# EAGLE design valve_indicatorV1 (EAGLE 9.6.2)

## Sheet 1 of 3: Power Regulators
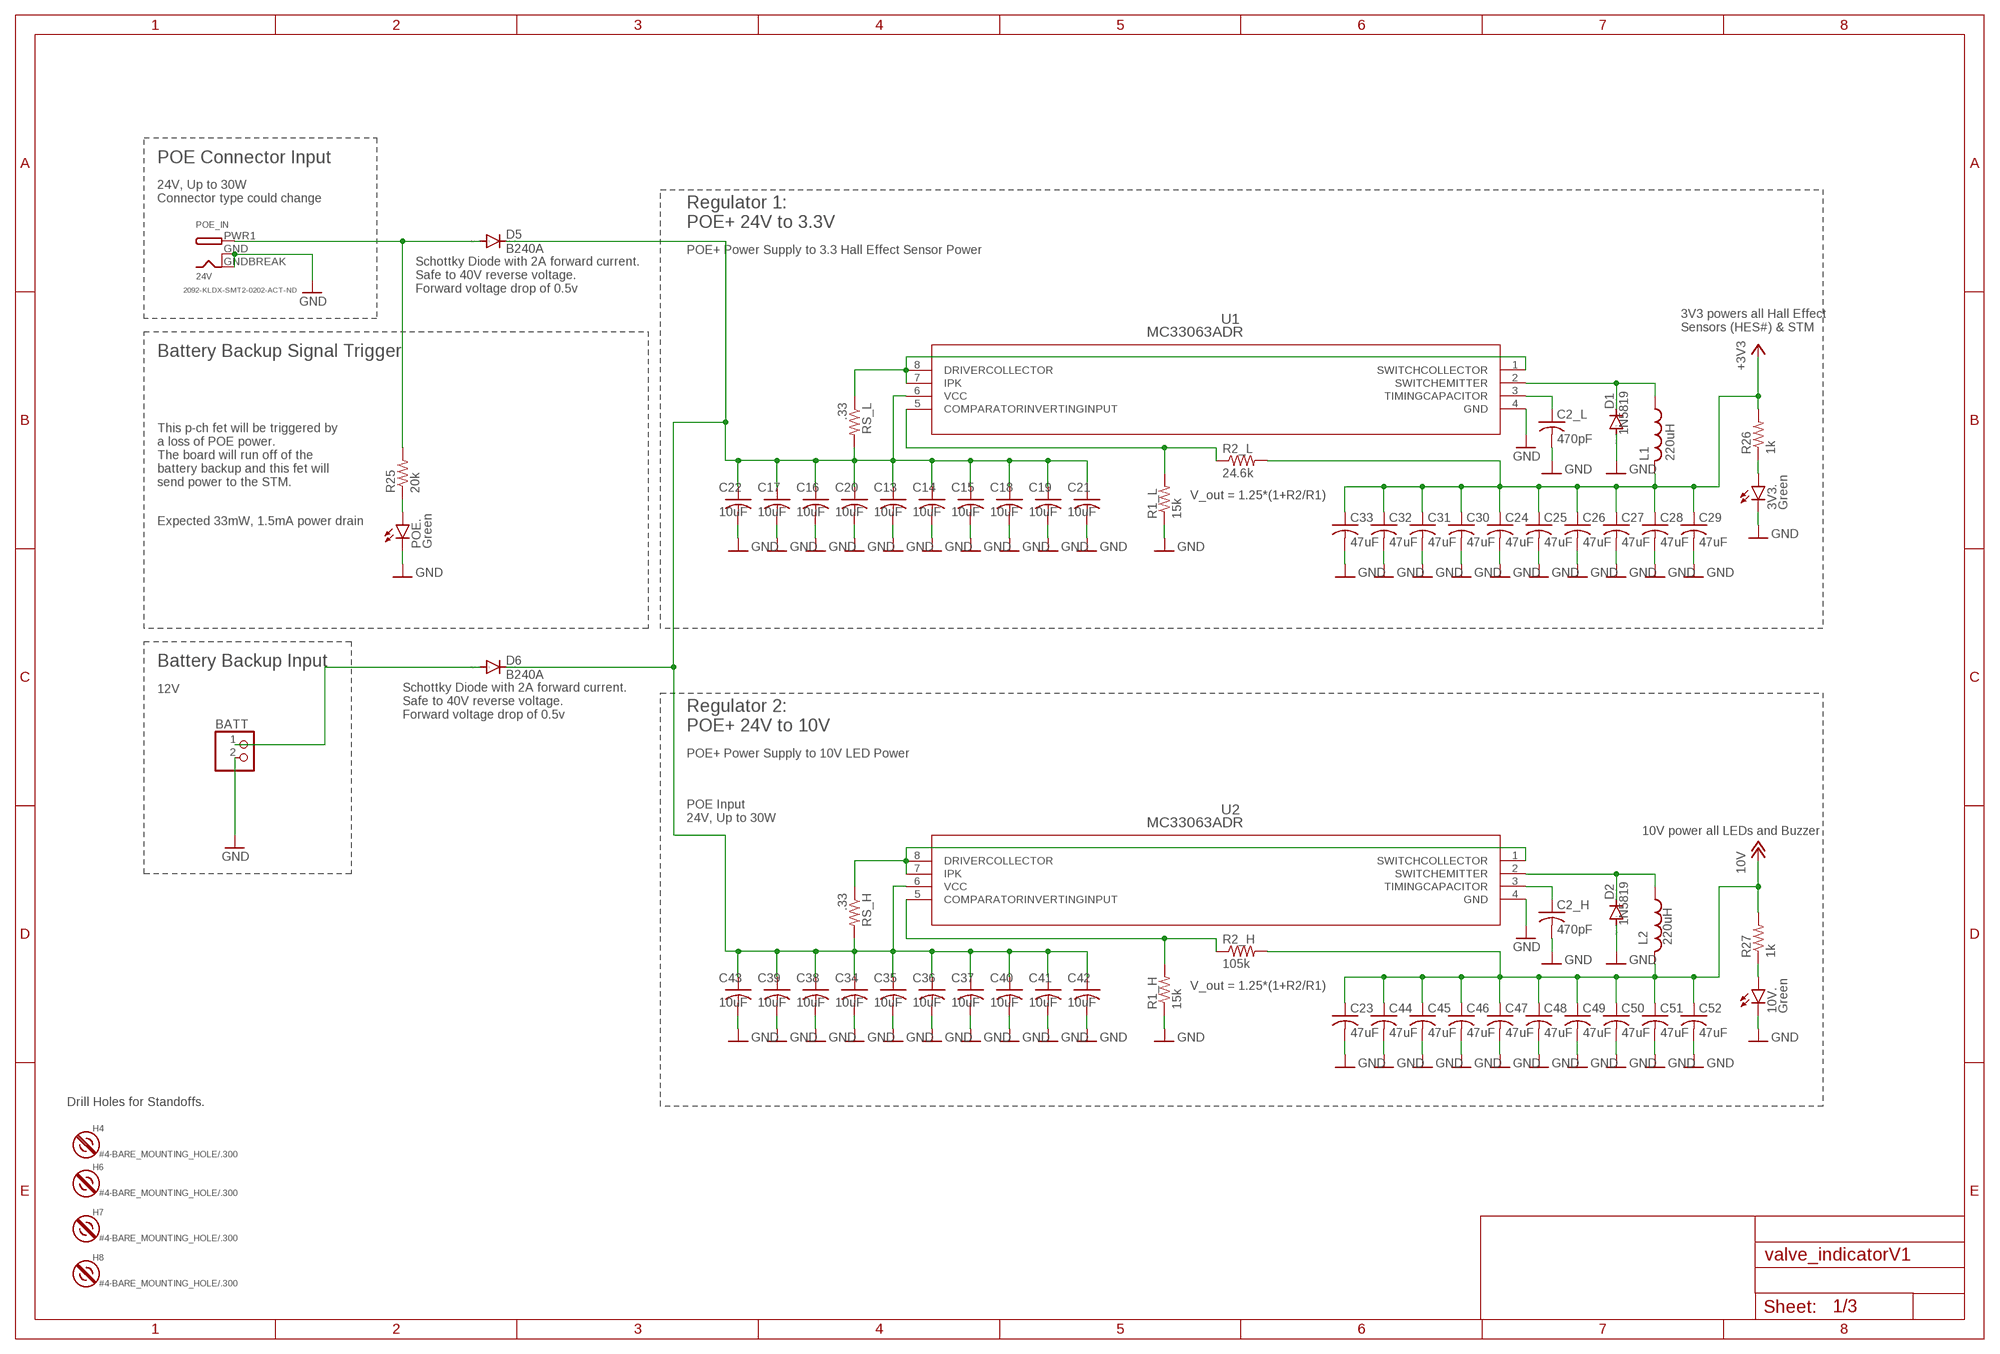
[diagram p0: schematic, sheet 1]

### Parts
3V3.  Green  LEDCHIP-LED0603  [CHIP-LED0603]
10V.  Green  LEDCHIP-LED0603  [CHIP-LED0603]
BATT  LED1  PINHD-1X2  [1X02]
C2_H  470pF  C-USC0603K  [C0603K]
C2_L  470pF  C-USC0603K  [C0603K]
C13  10uF  C-USC1206K  [C1206K]
C14  10uF  C-USC1206K  [C1206K]
C15  10uF  C-USC1206K  [C1206K]
C16  10uF  C-USC1206K  [C1206K]
C17  10uF  C-USC1206K  [C1206K]
C18  10uF  C-USC1206K  [C1206K]
C19  10uF  C-USC1206K  [C1206K]
C20  10uF  C-USC1206K  [C1206K]
C21  10uF  C-USC1206K  [C1206K]
C22  10uF  C-USC1206K  [C1206K]
C23  47uF  C-USC1206K  [C1206K]
C24  47uF  C-USC0805K  [C0805K]
C25  47uF  C-USC0805K  [C0805K]
C26  47uF  C-USC0805K  [C0805K]
C27  47uF  C-USC0805K  [C0805K]
C28  47uF  C-USC0805K  [C0805K]
C29  47uF  C-USC0805K  [C0805K]
C30  47uF  C-USC0805K  [C0805K]
C31  47uF  C-USC0805K  [C0805K]
C32  47uF  C-USC0805K  [C0805K]
C33  47uF  C-USC0805K  [C0805K]
C34  10uF  C-USC0805K  [C0805K]
C35  10uF  C-USC0805K  [C0805K]
C36  10uF  C-USC0805K  [C0805K]
C37  10uF  C-USC0805K  [C0805K]
C38  10uF  C-USC0805K  [C0805K]
C39  10uF  C-USC0805K  [C0805K]
C40  10uF  C-USC0805K  [C0805K]
C41  10uF  C-USC0805K  [C0805K]
C42  10uF  C-USC0805K  [C0805K]
C43  10uF  C-USC0805K  [C0805K]
C44  47uF  C-USC1206K  [C1206K]
C45  47uF  C-USC1206K  [C1206K]
C46  47uF  C-USC1206K  [C1206K]
C47  47uF  C-USC1206K  [C1206K]
C48  47uF  C-USC1206K  [C1206K]
C49  47uF  C-USC1206K  [C1206K]
C50  47uF  C-USC1206K  [C1206K]
C51  47uF  C-USC1206K  [C1206K]
C52  47uF  C-USC1206K  [C1206K]
D1  1N5819  DIODE-SOD123  [SOD123]
D2  1N5819  DIODE-SOD123  [SOD123]
D5  B240A  DIODE-DO214AC  [DO214AC]
D6  B240A  DIODE-DO214AC  [DO214AC]
H4  #4-BARE_MOUNTING_HOLE/.300  [#4/.300-BARE+STD_NUT_OR_STAR_WASHER]
H6  #4-BARE_MOUNTING_HOLE/.300  [#4/.300-BARE+STD_NUT_OR_STAR_WASHER]
H7  #4-BARE_MOUNTING_HOLE/.300  [#4/.300-BARE+STD_NUT_OR_STAR_WASHER]
H8  #4-BARE_MOUNTING_HOLE/.300  [#4/.300-BARE+STD_NUT_OR_STAR_WASHER]
L1  220uH  L-US0207/7  [0207/7]
L2  220uH  L-US0207/7  [0207/7]
POE.  Green  LEDCHIP-LED0603  [CHIP-LED0603]
POE_IN  24V  DCBARRELSMT  [DCJACK_2MM_SMT]
R1_H  15k  R-US_0805-C-NOSILK  [.0805-C-NOSILK]
R1_L  15k  R-US_0805-C-NOSILK  [.0805-C-NOSILK]
R2_H  105k  R-US_R1210  [R1210]
R2_L  24.6k  R-US_0805-C-NOSILK  [.0805-C-NOSILK]
R25  20k  R-US_0603-C-NOSILK  [.0603-C-NOSILK]
R26  1k  R-US_0603-C-NOSILK  [.0603-C-NOSILK]
R27  1k  R-US_0603-C-NOSILK  [.0603-C-NOSILK]
RS_H  .33  R-US_0603-C-NOSILK  [.0603-C-NOSILK]
RS_L  .33  R-US_0603-C-NOSILK  [.0603-C-NOSILK]
U1  MC33063ADR  [D8]
U2  MC33063ADR  [D8]

### Nets
+3V3: C24.1 C25.1 C26.1 C27.1 C28.1 C29.1 C30.1 C31.1 C32.1 C33.1 L1.3 R2_L.2 R26.2 ; also sheet 2,3
+10V: C23.1 C44.1 C45.1 C46.1 C47.1 C48.1 C49.1 C50.1 C51.1 C52.1 L2.3 R2_H.2 R27.2 ; supply symbol labelled 10V ; also sheet 2,3
GND: 3V3..C 10V..C BATT.2 C2_H.2 C2_L.2 C13.2 C14.2 C15.2 C16.2 C17.2 C18.2 C19.2 C20.2 C21.2 C22.2 C23.2 C24.2 C25.2 C26.2 C27.2 C28.2 C29.2 C30.2 C31.2 C32.2 C33.2 C34.2 C35.2 C36.2 C37.2 C38.2 C39.2 C40.2 C41.2 C42.2 C43.2 C44.2 C45.2 C46.2 C47.2 C48.2 C49.2 C50.2 C51.2 C52.2 D1.A D2.A POE..C POE_IN.GND(GNDBREAK) POE_IN.GNDBREAK(GND) R1_H.1 R1_L.1 U1.4(GND) U2.4(GND) ; also sheet 2,3
N$2: RS_L.1 U1.1(SWITCHCOLLECTOR) U1.7(IPK) U1.8(DRIVERCOLLECTOR)
N$3: D1.C L1.1 U1.2(SWITCHEMITTER)
N$4: C2_L.1 U1.3(TIMINGCAPACITOR)
N$5: R1_L.2 R2_L.1 U1.5(COMPARATORINVERTINGINPUT)
N$10: RS_H.1 U2.1(SWITCHCOLLECTOR) U2.7(IPK) U2.8(DRIVERCOLLECTOR)
N$12: D5.A POE_IN.PWR1(PWR) R25.2
N$14: POE..A R25.1
N$15: D2.C L2.1 U2.2(SWITCHEMITTER)
N$16: BATT.1 D6.A
N$17: 3V3..A R26.1
N$18: C2_H.1 U2.3(TIMINGCAPACITOR)
N$19: R1_H.2 R2_H.1 U2.5(COMPARATORINVERTINGINPUT)
N$21: 10V..A R27.1
POE: C13.1 C14.1 C15.1 C16.1 C17.1 C18.1 C19.1 C20.1 C21.1 C22.1 C34.1 C35.1 C36.1 C37.1 C38.1 C39.1 C40.1 C41.1 C42.1 C43.1 D5.C D6.C RS_H.2 RS_L.2 U1.6(VCC) U2.6(VCC)

### Notes on the sheet
- POE Connector Input
- 24V, Up to 30W 
  Connector type could change
- Regulator 1:
  POE+ 24V to 3.3V
- POE+ Power Supply to 3.3 Hall Effect Sensor Power
- 2092-KLDX-SMT2-0202-ACT-ND
- Schottky Diode with 2A forward current. 
  Safe to 40V reverse voltage. 
  Forward voltage drop of 0.5v
- 3V3 powers all Hall Effect 
  Sensors (HES#) & STM
- Battery Backup Signal Trigger
- This p-ch fet will be triggered by 
  a loss of POE power. 
  The board will run off of the 
  battery backup and this fet will 
  send power to the STM.
- V_out = 1.25*(1+R2/R1)
- Expected 33mW, 1.5mA power drain
- Battery Backup Input
- 12V
- Schottky Diode with 2A forward current. 
  Safe to 40V reverse voltage. 
  Forward voltage drop of 0.5v
- Regulator 2:
  POE+ 24V to 10V
- POE+ Power Supply to 10V LED Power
- POE Input 
  24V, Up to 30W
- 10V power all LEDs and Buzzer
- V_out = 1.25*(1+R2/R1)
- Drill Holes for Standoffs.

## Sheet 2 of 3: Processor
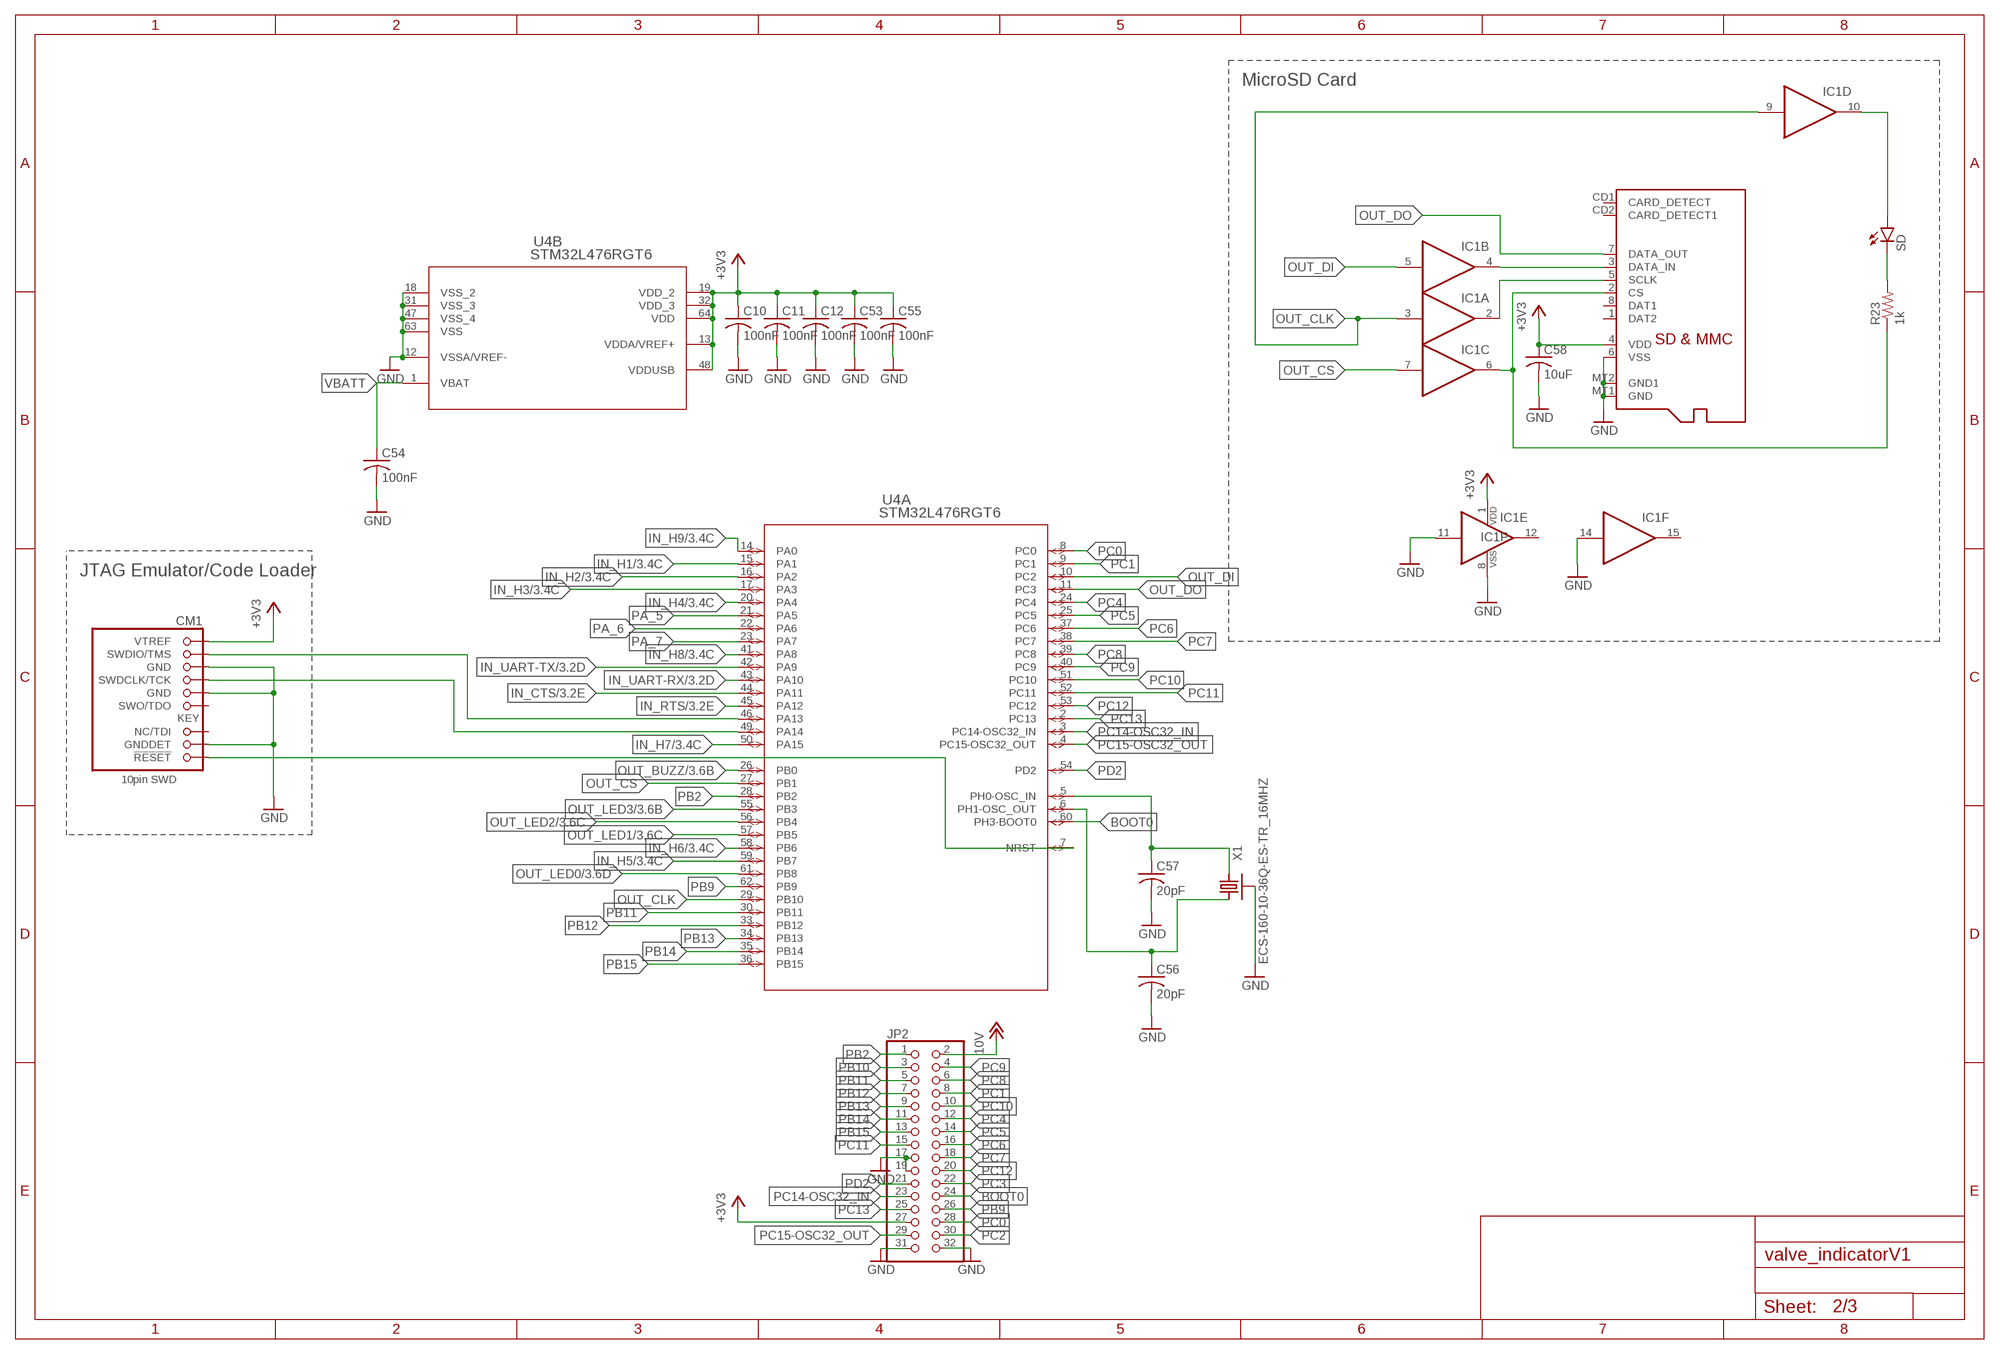
[diagram p1: schematic, sheet 2]

### Parts
C10  100nF  C-USC0603K  [C0603K]
C11  100nF  C-USC0603K  [C0603K]
C12  100nF  C-USC0603K  [C0603K]
C53  100nF  C-USC0603K  [C0603K]
C54  100nF  C-USC0603K  [C0603K]
C55  100nF  C-USC0603K  [C0603K]
C56  20pF  C-USC0402K  [C0402K]
C57  20pF  C-USC0402K  [C0402K]
C58  10uF  C-USC0805K  [C0805K]
CM1  FTSH-105-XX-X-DV-K  [CON10_2X5_DUK_FTSH]
IC1  4050D  [SO16]
JP2  PINHD-2X16  [2X16]
R23  1k  R-US_0603-C-NOSILK  [.0603-C-NOSILK]
SD  LEDCHIP-LED0603  [CHIP-LED0603]
U4  STM32L476RGT6  [LQFP64-10X10MM_STM]
X1  ECS-160-10-36Q-ES-TR_16MHZ  [2.5X2.0]
X2  MICROSD  [MICROSD]

### Nets
+3V3: C10.1 C11.1 C12.1 C53.1 C55.1 C58.1 CM1.1(VTREF) IC1.1(P:VDD) JP2.27 U4.13(B:VDDA/VREF+) U4.19(B:VDD_2) U4.32(B:VDD_3) U4.48(B:VDDUSB) U4.64(B:VDD) X2.4(VDD) ; also sheet 1,3
+10V: JP2.2 ; supply symbol labelled 10V ; also sheet 1,3
BOOT0: JP2.24 U4.60(A:PH3-BOOT0)
GND: C10.2 C11.2 C12.2 C53.2 C54.2 C55.2 C56.2 C57.2 C58.2 CM1.3(GND) CM1.5(GND) CM1.9(GNDDET) IC1.8(P:VSS) IC1.11(E:I) IC1.14(F:I) JP2.17 JP2.19 JP2.31 JP2.32 U4.12(B:VSSA/VREF-) U4.18(B:VSS_2) U4.31(B:VSS_3) U4.47(B:VSS_4) U4.63(B:VSS) X1.2(SHIELD) X1.4(SHIELD) X2.6(VSS) X2.MT1(GND) X2.MT2(GND1) ; also sheet 1,3
IN_CTS: U4.44(A:PA11) ; also sheet 3
IN_H1: U4.15(A:PA1) ; also sheet 3
IN_H2: U4.16(A:PA2) ; also sheet 3
IN_H3: U4.17(A:PA3) ; also sheet 3
IN_H4: U4.20(A:PA4) ; also sheet 3
IN_H5: U4.59(A:PB7) ; also sheet 3
IN_H6: U4.58(A:PB6) ; also sheet 3
IN_H7: U4.50(A:PA15) ; also sheet 3
IN_H8: U4.41(A:PA8) ; also sheet 3
IN_H9: U4.14(A:PA0) ; also sheet 3
IN_RTS: U4.45(A:PA12) ; also sheet 3
IN_UART-RX: U4.43(A:PA10) ; also sheet 3
IN_UART-TX: U4.42(A:PA9) ; also sheet 3
N$6: IC1.10(D:O) SD.A
N$8: IC1.2(A:O) X2.5(SCLK)
N$9: CM1.4(SWDCLK/TCK) U4.49(A:PA14)
N$20: IC1.6(C:O) R23.1 X2.2(CS)
N$22: R23.2 SD.C
N$23: IC1.4(B:O) X2.3(DATA_IN)
N$30: CM1.2(SWDIO/TMS) U4.46(A:PA13)
N$32: CM1.10(!RESET) U4.7(A:NRST)
OSC_IN: C57.1 U4.5(A:PH0-OSC_IN) X1.3
OSC_OUT: C56.1 U4.6(A:PH1-OSC_OUT) X1.1
OUT_BUZZ: U4.26(A:PB0) ; also sheet 3
OUT_CLK: IC1.3(A:I) IC1.9(D:I) U4.29(A:PB10)
OUT_CS: IC1.7(C:I) U4.27(A:PB1)
OUT_DI: IC1.5(B:I) U4.10(A:PC2)
OUT_DO: U4.11(A:PC3) X2.7(DATA_OUT)
OUT_LED0: U4.61(A:PB8) ; also sheet 3
OUT_LED1: U4.57(A:PB5) ; also sheet 3
OUT_LED2: U4.56(A:PB4) ; also sheet 3
OUT_LED3: U4.55(A:PB3) ; also sheet 3
PA_5: U4.21(A:PA5)
PA_6: U4.22(A:PA6)
PA_7: U4.23(A:PA7)
PB2: JP2.1 U4.28(A:PB2)
PB9: JP2.26 U4.62(A:PB9)
PB10: JP2.3
PB11: JP2.5 U4.30(A:PB11)
PB12: JP2.7 U4.33(A:PB12)
PB13: JP2.9 U4.34(A:PB13)
PB14: JP2.11 U4.35(A:PB14)
PB15: JP2.13 U4.36(A:PB15)
PC0: JP2.28 U4.8(A:PC0)
PC1: JP2.8 U4.9(A:PC1)
PC2: JP2.30
PC3: JP2.22
PC4: JP2.12 U4.24(A:PC4)
PC5: JP2.14 U4.25(A:PC5)
PC6: JP2.16 U4.37(A:PC6)
PC7: JP2.18 U4.38(A:PC7)
PC8: JP2.6 U4.39(A:PC8)
PC9: JP2.4 U4.40(A:PC9)
PC10: JP2.10 U4.51(A:PC10)
PC11: JP2.15 U4.52(A:PC11)
PC12: JP2.20 U4.53(A:PC12)
PC13: JP2.25 U4.2(A:PC13)
PC14-OSC32_IN: JP2.23 U4.3(A:PC14-OSC32_IN)
PC15-OSC32_OUT: JP2.29 U4.4(A:PC15-OSC32_OUT)
PD2: JP2.21 U4.54(A:PD2)
VBATT: C54.1 U4.1(B:VBAT)
Unconnected: CM1.6(SWO/TDO) CM1.8(NC/TDI) IC1.12(E:O) IC1.15(F:O) X2.1(DAT2) X2.8(DAT1) X2.CD1(CARD_DETECT) X2.CD2(CARD_DETECT1)

### Notes on the sheet
- MicroSD Card
- JTAG Emulator/Code Loader

## Sheet 3 of 3: Inputs & Outputs
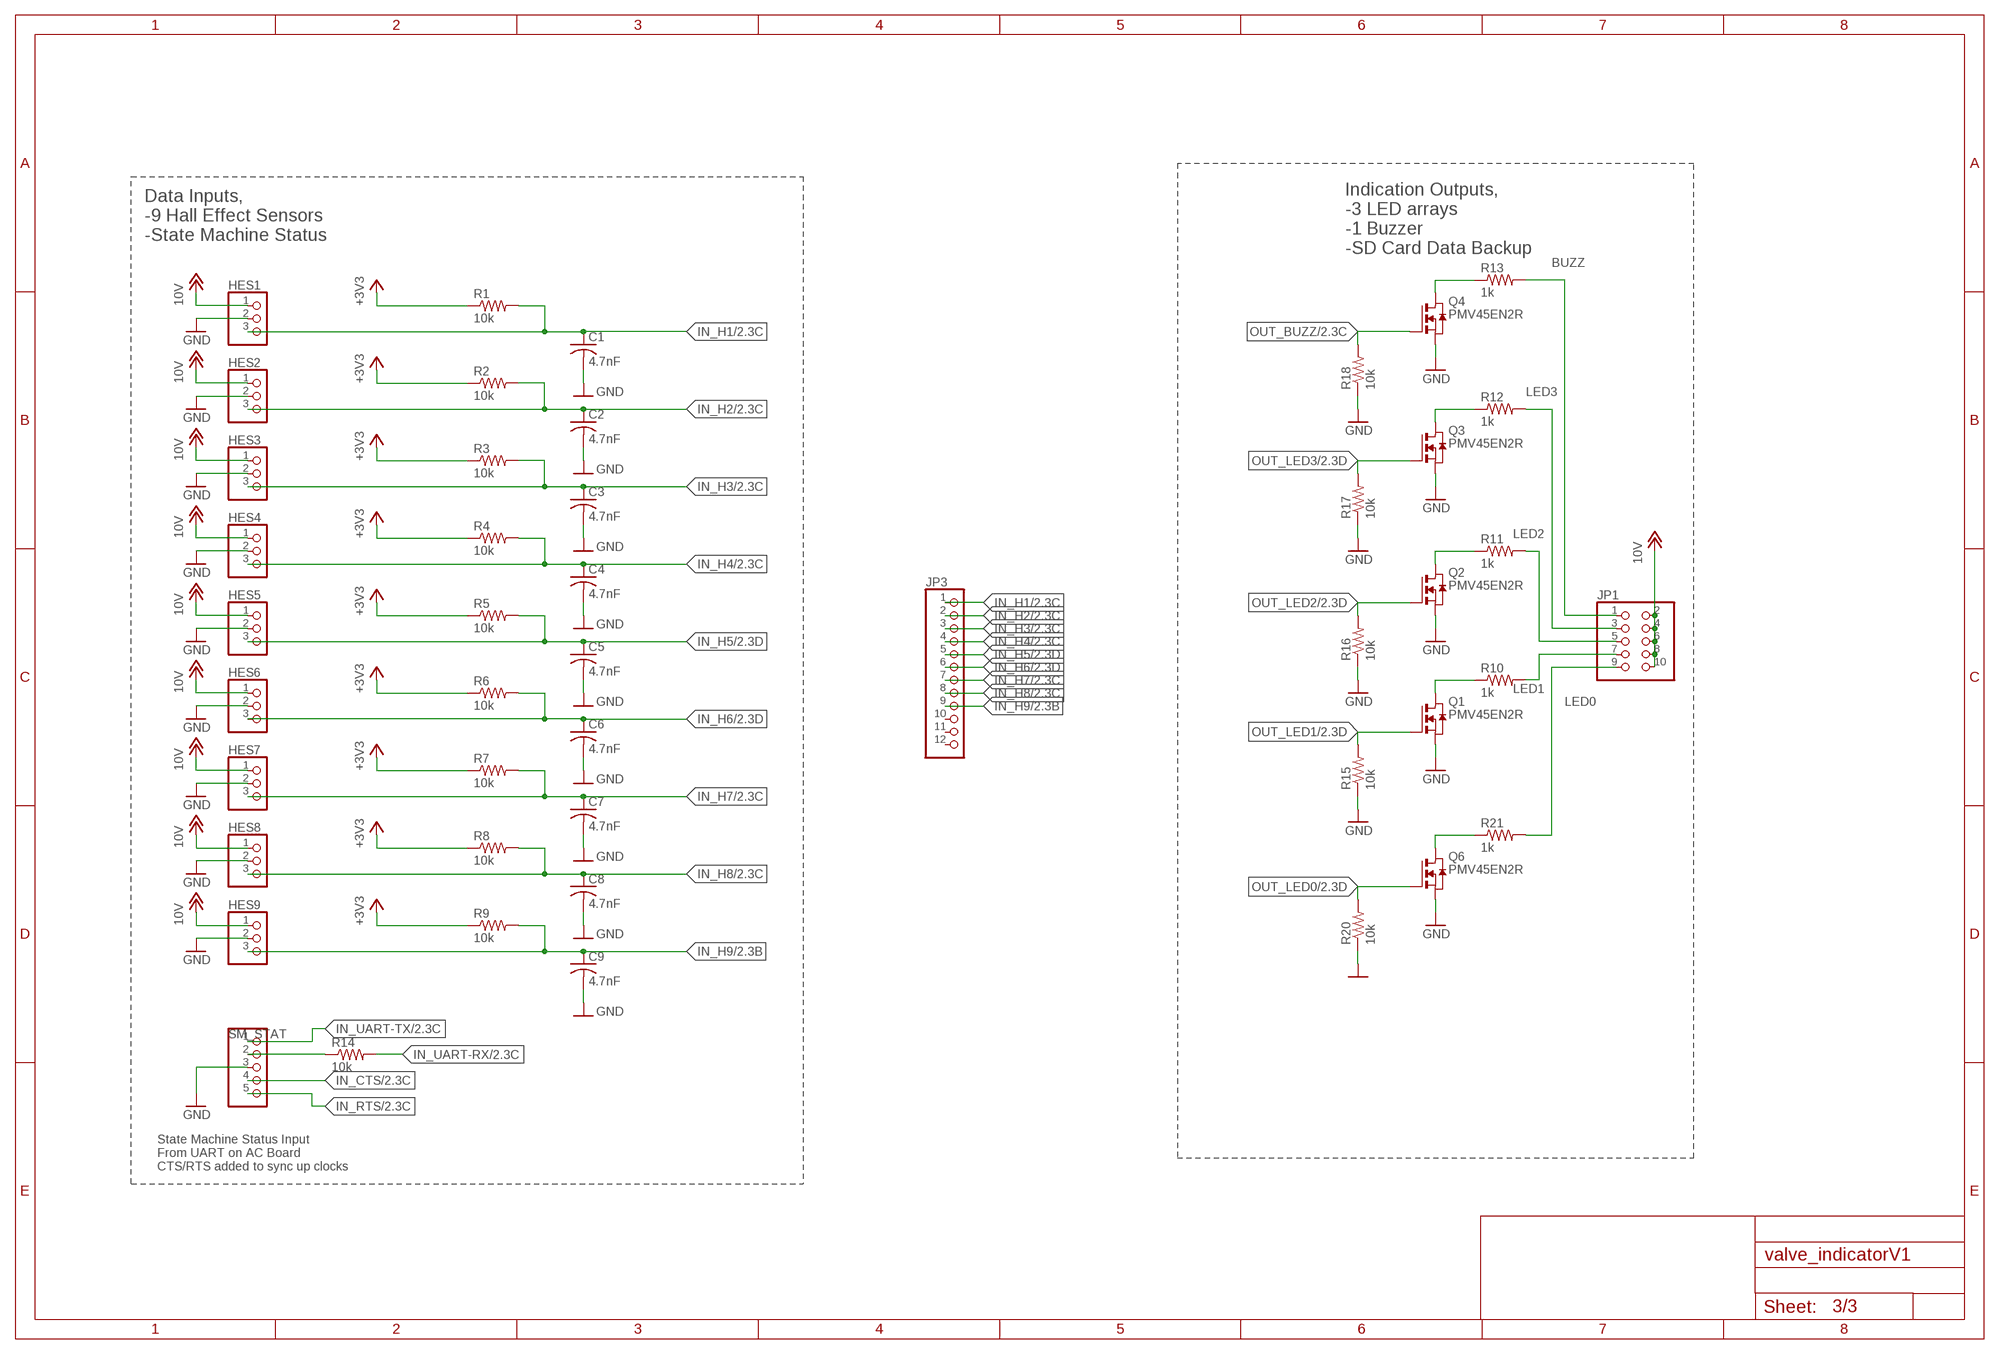
[diagram p2: schematic, sheet 3]

### Parts
C1  4.7nF  C-USC0603  [C0603]
C2  4.7nF  C-USC0603K  [C0603K]
C3  4.7nF  C-USC0603K  [C0603K]
C4  4.7nF  C-USC0603K  [C0603K]
C5  4.7nF  C-USC0603K  [C0603K]
C6  4.7nF  C-USC0603K  [C0603K]
C7  4.7nF  C-USC0603K  [C0603K]
C8  4.7nF  C-USC0603K  [C0603K]
C9  4.7nF  C-USC0603K  [C0603K]
HES1  HES1  PINHD-1X3  [1X03]
HES2  HES2  PINHD-1X3  [1X03]
HES3  HES3  PINHD-1X3  [1X03]
HES4  HES4  PINHD-1X3  [1X03]
HES5  HES5  PINHD-1X3  [1X03]
HES6  HES6  PINHD-1X3  [1X03]
HES7  HES7  PINHD-1X3  [1X03]
HES8  HES8  PINHD-1X3  [1X03]
HES9  HES9  PINHD-1X3  [1X03]
JP1  PINHD-2X5  [2X05]
JP3  PINHD-1X12  [1X12]
Q1  PMV45EN2R  [SOT23]
Q2  PMV45EN2R  [SOT23]
Q3  PMV45EN2R  [SOT23]
Q4  PMV45EN2R  [SOT23]
Q6  PMV45EN2R  [SOT23]
R1  10k  R-US_0603-C-NOSILK  [.0603-C-NOSILK]
R2  10k  R-US_0603-C-NOSILK  [.0603-C-NOSILK]
R3  10k  R-US_0603-C-NOSILK  [.0603-C-NOSILK]
R4  10k  R-US_0603-C-NOSILK  [.0603-C-NOSILK]
R5  10k  R-US_0603-C-NOSILK  [.0603-C-NOSILK]
R6  10k  R-US_0603-C-NOSILK  [.0603-C-NOSILK]
R7  10k  R-US_0603-C-NOSILK  [.0603-C-NOSILK]
R8  10k  R-US_0603-C-NOSILK  [.0603-C-NOSILK]
R9  10k  R-US_0603-C-NOSILK  [.0603-C-NOSILK]
R10  1k  R-US_0603-C-NOSILK  [.0603-C-NOSILK]
R11  1k  R-US_0603-C-NOSILK  [.0603-C-NOSILK]
R12  1k  R-US_0603-C-NOSILK  [.0603-C-NOSILK]
R13  1k  R-US_0603-C-NOSILK  [.0603-C-NOSILK]
R14  10k  R-US_0603-C-NOSILK  [.0603-C-NOSILK]
R15  10k  R-US_0603-C-NOSILK  [.0603-C-NOSILK]
R16  10k  R-US_0603-C-NOSILK  [.0603-C-NOSILK]
R17  10k  R-US_0603-C-NOSILK  [.0603-C-NOSILK]
R18  10k  R-US_0603-C-NOSILK  [.0603-C-NOSILK]
R20  10k  R-US_0603-C-NOSILK  [.0603-C-NOSILK]
R21  1k  R-US_R0603  [R0603]
SM_STAT  SM_STAT  PINHD-1X5  [1X05]

### Nets
+3V3: R1.1 R2.1 R3.1 R4.1 R5.1 R6.1 R7.1 R8.1 R9.1 ; also sheet 1,2
+10V: HES1.1 HES2.1 HES3.1 HES4.1 HES5.1 HES6.1 HES7.1 HES8.1 HES9.1 JP1.2 JP1.4 JP1.6 JP1.8 JP1.10 ; supply symbol labelled 10V ; also sheet 1,2
BUZZ: JP1.1 R13.2
GND: C1.2 C2.2 C3.2 C4.2 C5.2 C6.2 C7.2 C8.2 C9.2 HES1.2 HES2.2 HES3.2 HES4.2 HES5.2 HES6.2 HES7.2 HES8.2 HES9.2 Q1.2(S) Q2.2(S) Q3.2(S) Q4.2(S) Q6.2(S) R15.1 R16.1 R17.1 R18.1 R20.1 SM_STAT.3 ; also sheet 1,2
IN_CTS: SM_STAT.4 ; also sheet 2
IN_H1: C1.1 HES1.3 JP3.1 R1.2 ; also sheet 2
IN_H2: C2.1 HES2.3 JP3.2 R2.2 ; also sheet 2
IN_H3: C3.1 HES3.3 JP3.3 R3.2 ; also sheet 2
IN_H4: C4.1 HES4.3 JP3.4 R4.2 ; also sheet 2
IN_H5: C5.1 HES5.3 JP3.5 R5.2 ; also sheet 2
IN_H6: C6.1 HES6.3 JP3.6 R6.2 ; also sheet 2
IN_H7: C7.1 HES7.3 JP3.7 R7.2 ; also sheet 2
IN_H8: C8.1 HES8.3 JP3.8 R8.2 ; also sheet 2
IN_H9: C9.1 HES9.3 JP3.9 R9.2 ; also sheet 2
IN_RTS: SM_STAT.5 ; also sheet 2
IN_UART-RX: R14.2 ; also sheet 2
IN_UART-TX: SM_STAT.1 ; also sheet 2
LED0: JP1.9 R21.2
LED1: JP1.7 R10.2
LED2: JP1.5 R11.2
LED3: JP1.3 R12.2
N$1: Q4.3(D) R13.1
N$7: Q6.3(D) R21.1
N$13: Q3.3(D) R12.1
N$26: Q1.3(D) R10.1
N$27: Q2.3(D) R11.1
OUT_BUZZ: Q4.1(G) R18.2 ; also sheet 2
OUT_LED0: Q6.1(G) R20.2 ; also sheet 2
OUT_LED1: Q1.1(G) R15.2 ; also sheet 2
OUT_LED2: Q2.1(G) R16.2 ; also sheet 2
OUT_LED3: Q3.1(G) R17.2 ; also sheet 2
UART_RX: R14.1 SM_STAT.2
Unconnected: JP3.10 JP3.11 JP3.12

### Notes on the sheet
- Data Inputs, 
  -9 Hall Effect Sensors
  -State Machine Status
- Indication Outputs,
  -3 LED arrays
  -1 Buzzer
  -SD Card Data Backup
- State Machine Status Input
  From UART on AC Board
  CTS/RTS added to sync up clocks

## Library data of the parts
3V3. 10V. POE. SD = led:LED: LED OSRAM: - CHIPLED LG R971, LG N971, LY N971, LG Q971, LY Q971, LO R971, LY R971 LH N974, LH R974 LS Q976, LO Q976, LY Q976 LO Q996 - Hyper CHIPLED LW Q18S LB Q993, LB Q99A, LB R99A - SideLED LS A670, LO A670, LY A670, LG A670, LP A670 LB A673, LV A673, LT A673, LW A673 LH A674 LY A675 LS A676, LA A676, LO A676, LY A676, LW A676 LS A679, LY A679, LG A679 - Hyper Micro SIDELED® LS Y876, LA Y876, LO Y876, LY Y876 LT Y87S - SmartLED LW L88C, LW L88S LB L89C, LB L89S, LG L890 LS L89K, LO L89K, LY L89K LS L896, LA L896, LO L896, LY L896 - TOPLED LS T670, LO T670, LY T670, LG T670, LP T670 LSG T670, LSP T670, LSY T670, LOP T670, LYG T670 LG T671, LOG T671, LSG T671 LB T673, LV T673, LT T673, LW T673 LH T674 LS T676, LA T676, LO T676, LY T676, LB T676, LH T676, LSB T676, LW T676 LB T67C, LV T67C, LT T67C, LS T67K, LO T67K, LY T67K, LW E67C LS E67B, LA E67B, LO E67B, LY E67B, LB E67C, LV E67C, LT E67C LW T67C LS T679, LY T679, LG T679 LS T770, LO T770, LY T770, LG T770, LP T770 LB T773, LV T773, LT T773, LW T773 LH T774 LS E675, LA E675, LY E675, LS T675 LS T776, LA T776, LO T776, LY T776, LB T776 LHGB T686 LT T68C, LB T68C - Hyper Mini TOPLED® LB M676 - Mini TOPLED Santana® LG M470 LS M47K, LO M47K, LY M47K Source: http://www.osram.convergy.de LUXEON: - LUMILED® LXK2-PW12-R00, LXK2-PW12-S00, LXK2-PW14-U00, LXK2-PW14-V00 LXK2-PM12-R00, LXK2-PM12-S00, LXK2-PM14-U00 LXK2-PE12-Q00, LXK2-PE12-R00, LXK2-PE12-S00, LXK2-PE14-T00, LXK2-PE14-U00 LXK2-PB12-K00, LXK2-PB12-L00, LXK2-PB12-M00, LXK2-PB14-N00, LXK2-PB14-P00, LXK2-PB14-Q00 LXK2-PR12-L00, LXK2-PR12-M00, LXK2-PR14-Q00, LXK2-PR14-R00 LXK2-PD12-Q00, LXK2-PD12-R00, LXK2-PD12-S00 LXK2-PH12-R00, LXK2-PH12-S00 LXK2-PL12-P00, LXK2-PL12-Q00, LXK2-PL12-R00 Source: www.luxeon.com KINGBRIGHT: KA-3528ASYC Source: www.kingbright.com; DIS: Digi-Key; DPN: 350-2035-1-ND; MFR: Dialight; MPN: 5988070107F
BATT = pinhead:PINHD-1X2: PIN HEADER; DIS: Digi-Key; DPN: 900-0022232021-ND; MFR: Molex; MPN: 0022232021
C1 = rcl:C-US: CAPACITOR, American symbol; DIS: Digi-Key; DPN: 445-7400-1-ND; MFR: TDK Corporation; MPN: C1608C0G1H472J080AA; SPICEPREFIX: C
C2-C9 = oresat-rcl:C-US: CAPACITOR, American symbol; DIS: Digi-Key; DPN: 445-7400-1-ND; MFR: TDK Corporation; MPN: C1608C0G1H472J080AA
C2_H C2_L = oresat-rcl:C-US: CAPACITOR, American symbol; DIS: Digi-Key; DPN: 1292-1438-1-ND; MFR: Walsin Technology Corporation; MPN: 0603B471K500CT
C10-C12 C53-C55 = oresat-rcl:C-US: CAPACITOR, American symbol; DIS: Digi-Key; DPN: 1276-1006-1-ND; MFR: Samsung Electro-Mechanics; MPN: CL10B104KA8NNNC
C13-C22 = oresat-rcl:C-US: CAPACITOR, American symbol; DIS: Digi-Key; DPN: 1276-2876-1-ND; MFR: Samsung Electro-Mechanics; MPN: CL31A106KBHNNNE
C23 C44-C52 = oresat-rcl:C-US: CAPACITOR, American symbol; DIS: Digi-Key; DPN: 445-8047-1-ND; MFR: TDK Corporation; MPN: C3216X5R1E476M160AC
C24-C33 = oresat-rcl:C-US: CAPACITOR, American symbol; DIS: Digi-Key; DPN: 445-8239-1-ND; MFR: TDK Corporation; MPN: C2012X5R1A476M125AC
C34-C43 = oresat-rcl:C-US: CAPACITOR, American symbol; DIS: Digi-Key; DPN: 490-18664-1-ND; MFR: Murata Electronics; MPN: GRM21BR61H106ME43L
C56 C57 = oresat-rcl:C-US: CAPACITOR, American symbol; DIS: Digi-Key; DPN: 399-8786-1-ND; MFR: KEMET; MPN: CBR04C200F5GAC
C58 = oresat-rcl:C-US: CAPACITOR, American symbol; DIS: Digi-Key; DPN: 1276-6456-1-ND; MFR: Samsung Electro-Mechanics; MPN: CL21A106KPFNNNG
CM1 = J-Samtec-FTSH-105-XXX-DV-K-ARM-SWD:FTSH-105-XX-X-DV-K; DIS: Digi-Key; DPN: SAM13160CT-ND; MFR: Samtec Inc.; MPN: FTSH-105-01-F-DV-K-TR
D1 D2 = diode:DIODE-: DIODE; DIS: Digi-Key; DPN: 1N5819HW-FDICT-ND; MFR: Diodes Incorporated; MPN: 1N5819HW-7-F
D5 D6 = diode:DIODE-: DIODE; DIS: Digi-Key; DPN: B240A-FDICT-ND; MFR: Diodes Incorporated; MPN: B240A-13-F
H4 H6-H8 = mount:#4-BARE_MOUNTING_HOLE: 1/8" drill hole for #4 screw mount
HES1-HES9 = pinhead:PINHD-1X3: PIN HEADER; DIS: Digi-Key; DPN: WM10158-ND; MFR: Molex; MPN: 1718570003
IC1 = 40xx:4050: Hex non-inverting BUFFER; DIS: Digi-Key; DPN: 296-9214-5-ND; MFR: Texas Instruments; MPN: CD74HC4050M
JP1 = pinhead:PINHD-2X5: PIN HEADER; DIS: Digi-Key; DPN: AE11083-ND; MFR: Molex; MPN: AWHW 10A-0202-T
JP2 = pinhead:PINHD-2X16: PIN HEADER; DIS: Digi-Key; DPN: S2011EC-16-ND; MFR: Sullins Connector Solutions; MPN: PRPC016DAAN-RC
JP3 = pinhead:PINHD-1X12: PIN HEADER; DIS: Digi-Key; DPN: WM10196-ND; MFR: Molex; MPN: 1718570012
L1 L2 = 12RS224C:L-US: INDUCTOR, American symbol; DIS: Digi-Key; DPN: 811-2101-ND; MFR: Murata Power Solutions Inc.; MPN: 12RS224C; SPICEPREFIX: L
POE_IN = adafruit:DCBARREL: 2.0mm DC Barrel Jack DCJACK_2MM_PTH - Through Hole Jack (4UConnector: 05537); DIS: Digi-Key; DPN: 2092-KLDX-SMT2-0202-ACT-ND; MFR: Kycon, Inc.; MPN: KLDX-SMT2-0202-ATR
Q1-Q4 Q6 = Q-Nexperia-Nchannel-MOSFET-PMV45EN2R:PMV45EN2R: Nexperia PMV45EN2R N-channel MOSFET, 5.1 A, 30 V PMV45EN2, 3-Pin SOT-23 Source: Datasheet <http://uk.rs-online.com/web/p/products/1364806>; DESCRIPTION: Nexperia PMV45EN2R N-channel MOSFET, 5.1 A, 30 V PMV45EN2, 3-Pin SOT-23; DIS: Digi-Key; DPN: 1727-2307-1-ND; HEIGHT: 1.1mm; MANUFACTURER_NAME: Nexperia; MANUFACTURER_PART_NUMBER: PMV45EN2R; MFR: Nexperia USA Inc.; MOUSER_PART_NUMBER: 771-PMV45EN2R; MOUSER_PRICE-STOCK: https://www.mouser.com/Search/Refine.aspx?Keyword=771-PMV45EN2R; MPN: PMV45EN2R; RS_PART_NUMBER: 1364835P; RS_PRICE-STOCK: http://uk.rs-online.com/web/p/products/1364835P
R1-R9 R14-R18 R20 = oresat-rcl:R-US_: RESISTOR, American symbol; DIS: Digi-Key; DPN: RMCF0603FT10K0CT-ND; MFR: Stackpole Electronics Inc; MPN: RMCF0603FT10K0
R1_H R1_L = oresat-rcl:R-US_: RESISTOR, American symbol; DIS: Digi-Key; DPN: 541-15.0KTCT-ND; MFR: Vishay Dale; MPN: CRCW080515K0FKEAHP
R2_H = oresat-rcl:R-US_: RESISTOR, American symbol; DIS: Digi-Key; DPN: P105KAACT-ND; MFR: Panasonic Electronic Components; MPN: ERJ-14NF1053U
R2_L = oresat-rcl:R-US_: RESISTOR, American symbol; DIS: Digi-Key; DPN: 541-24.9KTCT-ND; MFR: Vishay Dale; MPN: CRCW080524K9FKEAHP
R10-R13 = oresat-rcl:R-US_: RESISTOR, American symbol; DIS: Digi-Key; DPN: RMCF0603JJ1K00CT-ND; MFR: Stackpole Electronics Inc; MPN: RMCF0603JJ1K00
R21 = rcl:R-US_: RESISTOR, American symbol; DIS: Digi-Key; DPN: RMCF0603JJ1K00CT-ND; MFR: Stackpole Electronics Inc; MPN: RMCF0603JJ1K00; SPICEPREFIX: R
R23 R26 R27 = oresat-rcl:R-US_: RESISTOR, American symbol; DIS: Digi-Key; DPN: 511-1732-1-ND; MFR: Rohm Semiconductor; MPN: SDR03EZPJ102
R25 = oresat-rcl:R-US_: RESISTOR, American symbol; DIS: Digi-Key; DPN: RHM20KDCT-ND; MFR: Rohm Semiconductor; MPN: ESR03EZPJ203
RS_H RS_L = oresat-rcl:R-US_: RESISTOR, American symbol; DIS: Digi-Key; DPN: P.33AJCT-ND; MFR: Panasonic Electronic Components; MPN: ERJ-3RQFR33V
SM_STAT = pinhead:PINHD-1X5: PIN HEADER; DIS: Digi-Key; DPN: AE11083-ND; MFR: Molex; MPN: AWHW 10A-0202-T
U1 U2 = MC33063ADR:MC33063ADR; DATASHEET_URL: http://www.ti.com/lit/gpn/MC33063A; DESCRIPTION: 1.5-A Peak Boost/Buck/Inverting Switching Regulator; DIS: Digi-Key; DPN: 296-17763-1-ND; FAMILY_NAME: INVERTING REGULATOR; GENERIC_PART_NUMBER: MC33063A; INDUSTRY_STD_PKG_TYPE: SOIC; MANUFACTURER: Texas Instruments; MANUFACTURER_PART_NUMBER: MC33063ADR; MFR: Texas Instruments; MPN: MC33063ADR; PACKAGE_DESIGNATOR: D; PIN_COUNT: 8; VENDOR: Texas Instruments
U4 = STM32L476RGT6:STM32L476RGT6; BUILT_BY: EMA_UL_Team; COPYRIGHT: Copyright (C) 2018 Accelerated Designs. All rights reserved; DIS: Digi-Key; DPN: 497-15877-ND; MANUFACTURER_PART_NUMBER: STM32L476RGT6; MFR: STMicroelectronics; MPN: STM32L476RGT6; SOURCELIBRARY: Updates_to_database_2020-10-19; VENDOR: STMicroelectronics
X1 = X-ECS-160-10-36Q-ES-TR-16MHz:ECS-160-10-36Q-ES-TR_16MHZ: https://www.ecsxtal.com/store/pdf/ECX-2236Q.pdf CRYSTAL 16.000MHZ 10PF SMD; DESCRIPTION: 16MHz ±30ppm Crystal 10pF 80 Ohms 4-SMD, No Lead; DIGI-KEY_PART_NUMBER: XC2181CT-ND; DIS: Digi-Key; DPN: XC2181CT-ND; MANUFACTURER: ECS Inc.; MANUFACTURER_PART_NUMBER: ECS-160-10-36Q-ES-TR; MFR: ECS Inc.; MPN: ECS-160-10-36Q-ES-TR
X2 = adafruit:MICROSD: Micro-SD / Transflash card holder with SPI pinout For the 3M # 2908-05WB-MG and/or 4UCON #19656 push-push type; DIS: Digi-Key; DPN: 2073-MEM2061-01-188-00-ACT-ND; MFR: GCT; MPN: MEM2061-01-188-00-A

## Board
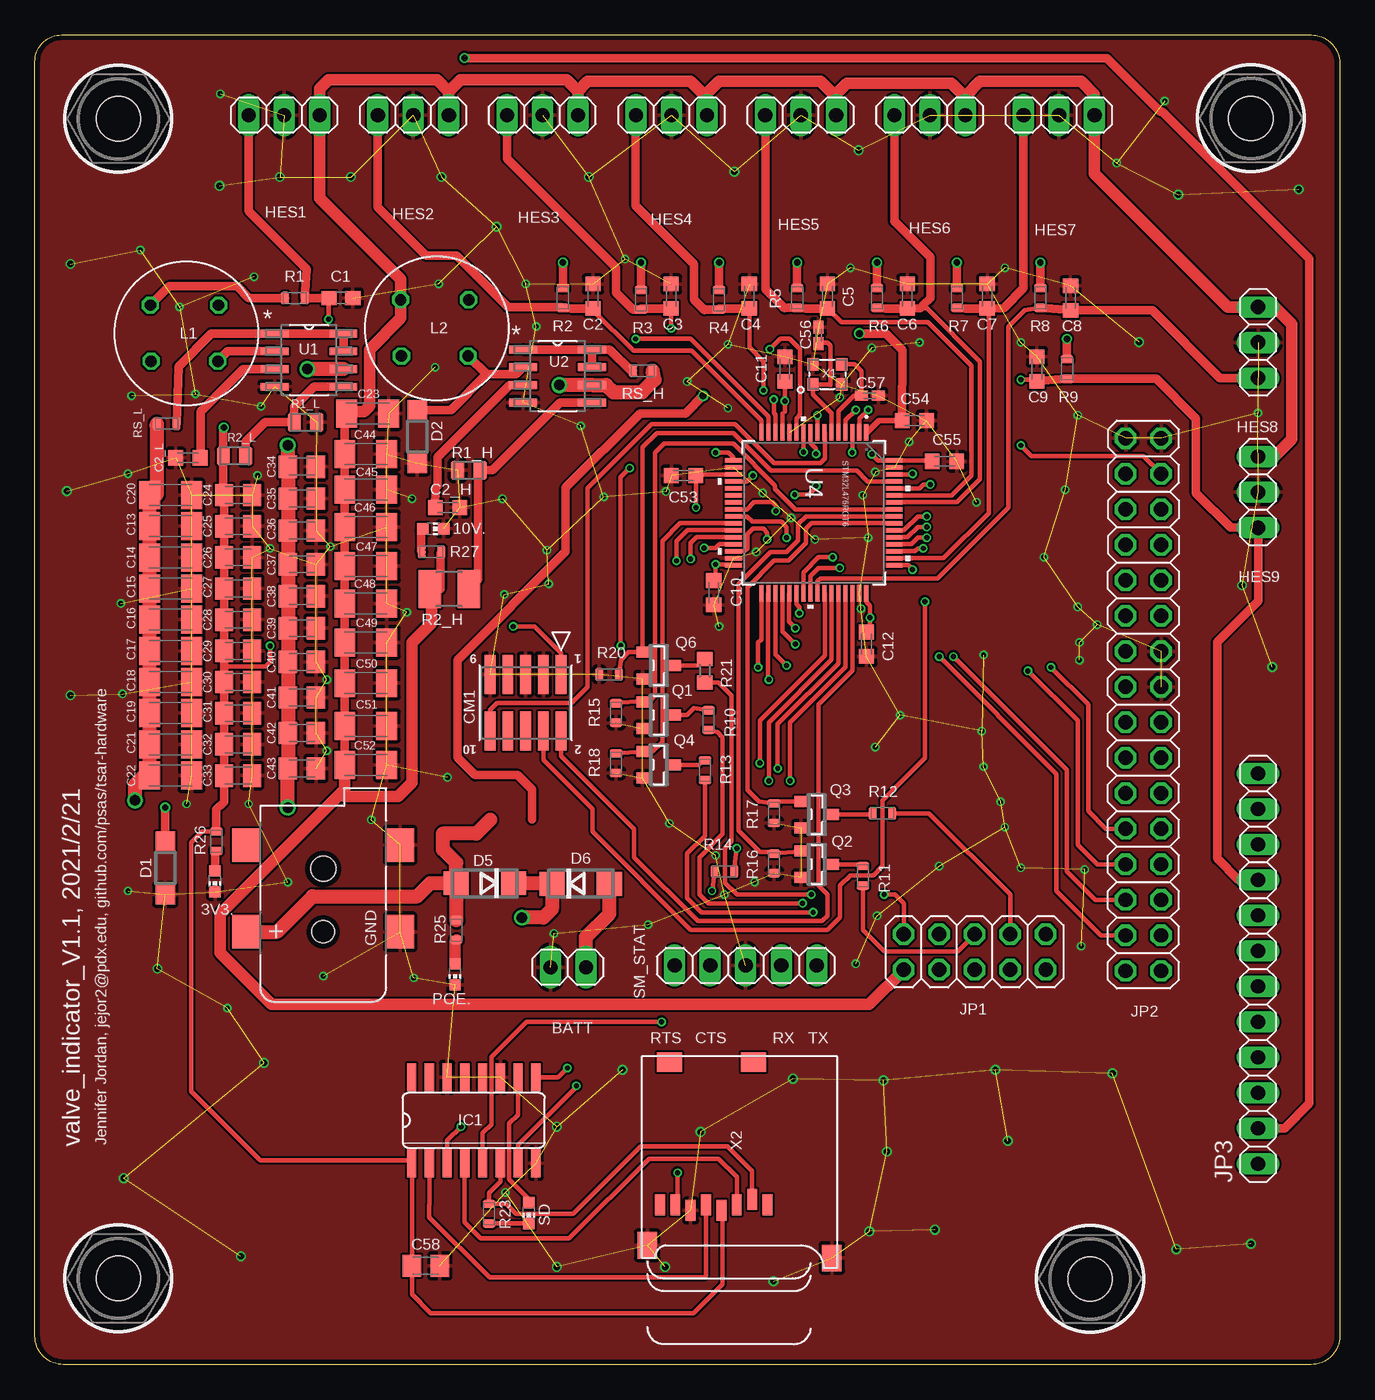
[diagram p3: board, top side]
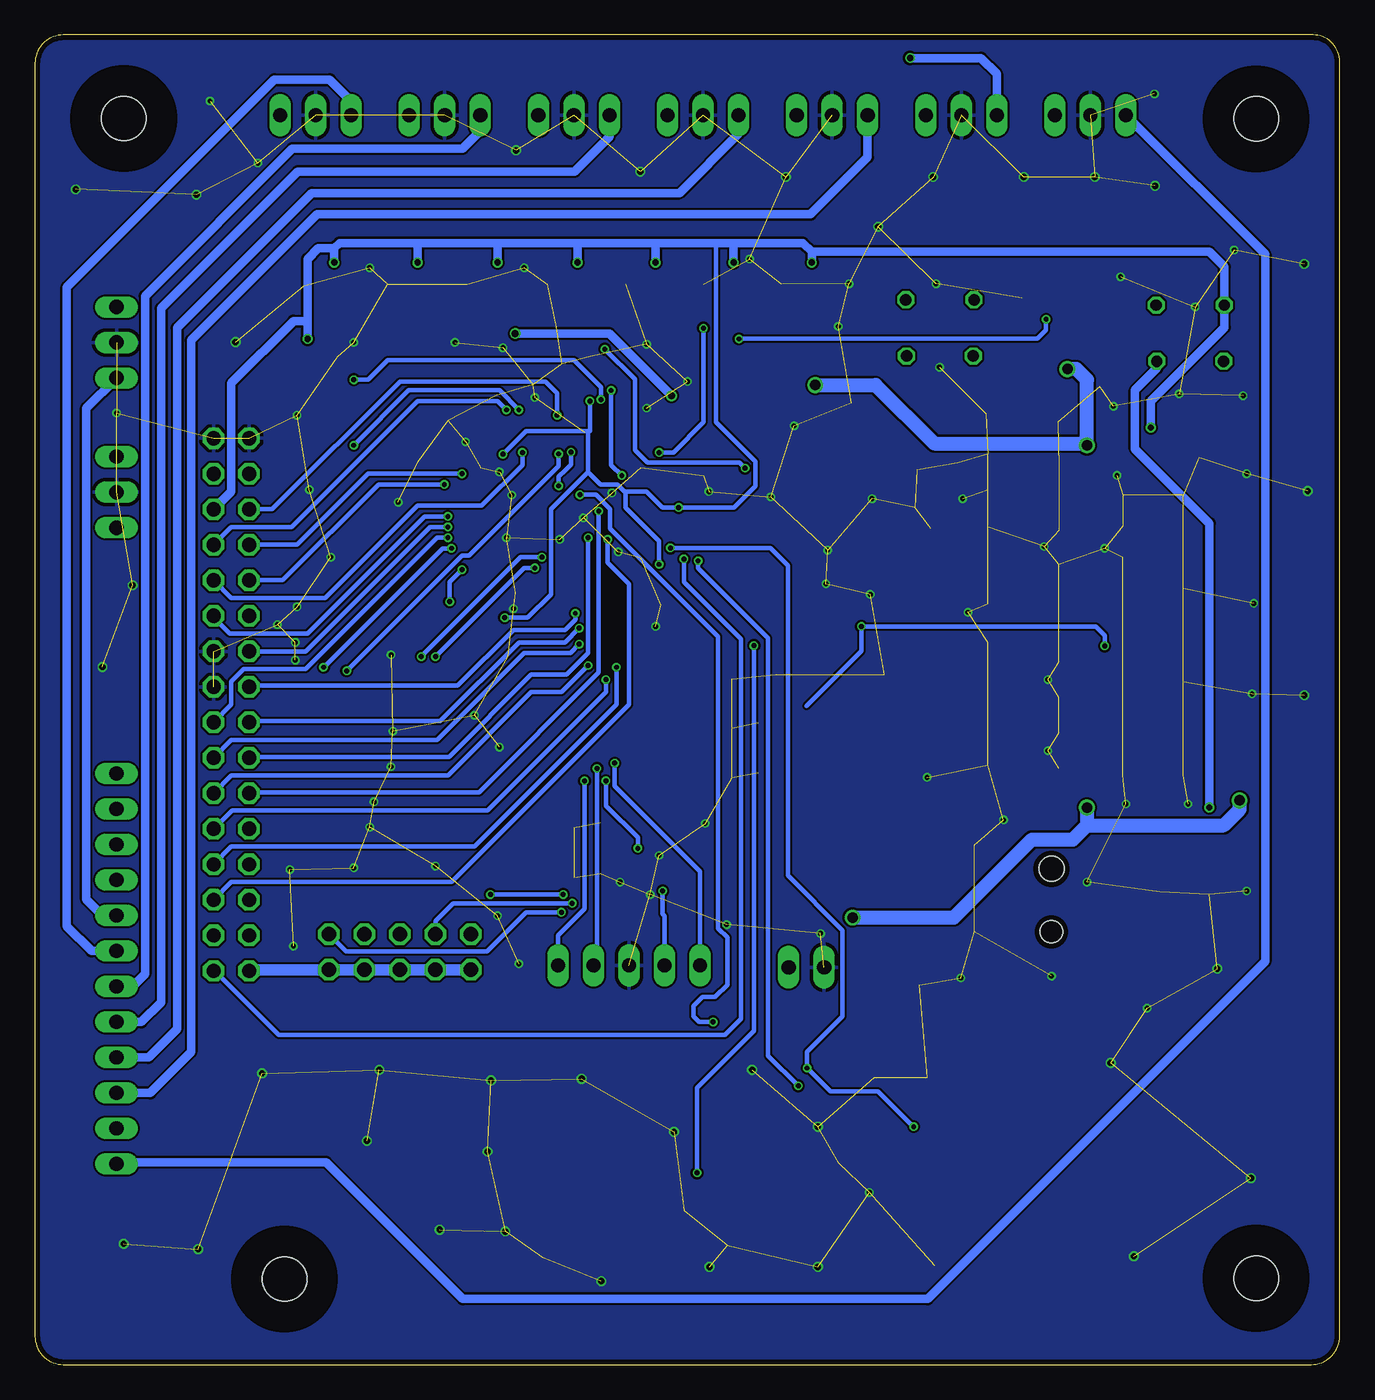
[diagram p4: board, bottom side, seen from below]

Size 93.34 x 95.12 mm. Coordinates in mm from the lower left corner, seen from the top.
Outline: 0,93.22 arc-90 1.91,95.12 91.31,95.12 arc-90 93.34,93.09 93.34,2.03 arc-90 91.31,0 2.03,0 arc-90 0,2.03 0,93.22
Copper layers (1*16): Top 0.035559375mm / dielectric 1.6mm / Bottom 0.035559375mm
Design rules "oshpark-2layer": minimum track width 6mil, minimum drill 10mil, track to track 6mil, track to pad 6mil, pad to pad 6mil, via to via 6mil, smd to smd 6mil, copper to edge 15mil, drill to drill 6mil, minimum pad ring 5mil, minimum via ring 5mil, stop-mask expansion 2.5mil, vias tented up to drill 0mil, thermal gap 10mil

### Footprints (pad centres in the part's own frame; a part is rotated, then mirrored left to right if it is on the bottom)
CHIP-LED0603 = smd 0.8 x 0.8: A 0,-0.75; C 0,0.75
1X02 = drill 1.016 long: 1 -1.27,0; 2 1.27,0
C0603 = smd 1.1 x 1: 1 -0.85,0; 2 0.85,0
C0603K = smd 1.05 x 1.08: 1 -0.875,0; 2 0.875,0
C1206K = smd 1.5 x 2: 1 -1.5,0; 2 1.5,0
C0805K = smd 1.3 x 1.6: 1 -1,0; 2 1,0
C0402K = smd 0.925 x 0.74: 1 -0.6,0; 2 0.6,0
CON10_2X5_DUK_FTSH = smd 0.762 x 2.794: 1 -2.54,-2.032; 2 -2.54,2.032; 3 -1.27,-2.032; 4 -1.27,2.032; 5 0,-2.032; 6 0,2.032; 7 1.27,-2.032; 8 1.27,2.032; 9 2.54,-2.032; 10 2.54,2.032
SOD123 = smd 1.4 x 1.4: A 1.9,0; C -1.9,0
DO214AC = smd 1.8 x 1.7: A 2.05,0; C -2.05,0
#4/.300-BARE+STD_NUT_OR_STAR_WASHER = hole 3.175: 0,0
1X03 = drill 1.016 long: 1 -2.54,0; 2 0,0; 3 2.54,0
SO16 = smd 0.66 x 2.032: 1 -4.445,-3.073; 2 -3.175,-3.073; 3 -1.905,-3.073; 4 -0.635,-3.073; 5 0.635,-3.073; 6 1.905,-3.073; 7 3.175,-3.073; 8 4.445,-3.073; 9 4.445,3.073; 10 3.175,3.073; 11 1.905,3.073; 12 0.635,3.073; 13 -0.635,3.073; 14 -1.905,3.073; 15 -3.175,3.073; 16 -4.445,3.073
2X05 = drill 1.016 octagon: 1 -5.08,-1.27; 2 -5.08,1.27; 3 -2.54,-1.27; 4 -2.54,1.27; 5 0,-1.27; 6 0,1.27; 7 2.54,-1.27; 8 2.54,1.27; 9 5.08,-1.27; 10 5.08,1.27
2X16 = drill 1.016 octagon: 1 -19.05,-1.27; 2 -19.05,1.27; 3 -16.51,-1.27; 4 -16.51,1.27; 5 -13.97,-1.27; 6 -13.97,1.27; 7 -11.43,-1.27; 8 -11.43,1.27; 9 -8.89,-1.27; 10 -8.89,1.27; 11 -6.35,-1.27; 12 -6.35,1.27; 13 -3.81,-1.27; 14 -3.81,1.27; 15 -1.27,-1.27; 16 -1.27,1.27; 17 1.27,-1.27; 18 1.27,1.27; 19 3.81,-1.27; 20 3.81,1.27; 21 6.35,-1.27; 22 6.35,1.27; 23 8.89,-1.27; 24 8.89,1.27; 25 11.43,-1.27; 26 11.43,1.27; 27 13.97,-1.27; 28 13.97,1.27; 29 16.51,-1.27; 30 16.51,1.27; 31 19.05,-1.27; 32 19.05,1.27
1X12 = drill 1.016 long: 1 -13.97,0; 2 -11.43,0; 3 -8.89,0; 4 -6.35,0; 5 -3.81,0; 6 -1.27,0; 7 1.27,0; 8 3.81,0; 9 6.35,0; 10 8.89,0; 11 11.43,0; 12 13.97,0
0207/7 = drill 0.813 octagon: 1 1.981,2.235; 2 1.981,-2.54; 3 -2.032,-2.591; 4 -2.032,2.286
DCJACK_2MM_SMT = smd 2.4 x 2: GND 0,-5.5; GNDBREAK 6.2,-5.5; PWR1 0,5.5; PWR2 6.2,5.5 | hole 1.6: 0,0 | hole 1.8: 4.5,0
SOT23 = smd 0.787 x 0.889: 1 -0.953,-1.143; 2 0.953,-1.143; 3 0,1.143
.0603-C-NOSILK = smd 0.6 x 0.9: 1 -0.7,0; 2 0.7,0
.0805-C-NOSILK = smd 0.95 x 1.35: 1 -0.8,0; 2 0.8,0
R1210 = smd 1.6 x 2.7: 1 -1.4,0; 2 1.4,0
R0603 = smd 1 x 1.1: 1 -0.85,0; 2 0.85,0
1X05 = drill 1.016 long: 1 -5.08,0; 2 -2.54,0; 3 0,0; 4 2.54,0; 5 5.08,0
D8 = smd 1.981 x 0.559: 1 -2.464,1.905; 2 -2.464,0.635; 3 -2.464,-0.635; 4 -2.464,-1.905; 5 2.464,-1.905; 6 2.464,-0.635; 7 2.464,0.635; 8 2.464,1.905
LQFP64-10X10MM_STM = smd 1.194 x 0.305: 1 -5.75,3.75; 2 -5.75,3.25; 3 -5.75,2.75; 4 -5.75,2.25; 5 -5.75,1.75; 6 -5.75,1.25; 7 -5.75,0.75; 8 -5.75,0.25; 9 -5.75,-0.25; 10 -5.75,-0.75; 11 -5.75,-1.25; 12 -5.75,-1.75; 13 -5.75,-2.25; 14 -5.75,-2.75; 15 -5.75,-3.25; 16 -5.75,-3.75; 33 5.75,-3.75; 34 5.75,-3.25; 35 5.75,-2.75; 36 5.75,-2.25; 37 5.75,-1.75; 38 5.75,-1.25; 39 5.75,-0.75; 40 5.75,-0.25; 41 5.75,0.25; 42 5.75,0.75; 43 5.75,1.25; 44 5.75,1.75; 45 5.75,2.25; 46 5.75,2.75; 47 5.75,3.25; 48 5.75,3.75 | smd 0.305 x 1.194: 17 -3.75,-5.75; 18 -3.25,-5.75; 19 -2.75,-5.75; 20 -2.25,-5.75; 21 -1.75,-5.75; 22 -1.25,-5.75; 23 -0.75,-5.75; 24 -0.25,-5.75; 25 0.25,-5.75; 26 0.75,-5.75; 27 1.25,-5.75; 28 1.75,-5.75; 29 2.25,-5.75; 30 2.75,-5.75; 31 3.25,-5.75; 32 3.75,-5.75; 49 3.75,5.75; 50 3.25,5.75; 51 2.75,5.75; 52 2.25,5.75; 53 1.75,5.75; 54 1.25,5.75; 55 0.75,5.75; 56 0.25,5.75; 57 -0.25,5.75; 58 -0.75,5.75; 59 -1.25,5.75; 60 -1.75,5.75; 61 -2.25,5.75; 62 -2.75,5.75; 63 -3.25,5.75; 64 -3.75,5.75
2.5X2.0 = smd 0.8 x 0.9: 1 -1.025,-0.725; 2 1.025,-0.725; 3 1.025,0.725; 4 -1.025,0.725
MICROSD = smd 0.7 x 1.5: 1 9,-10.64; 2 7.9,-10.24; 3 6.8,-10.64; 4 5.7,-11.04; 5 4.6,-10.64; 6 3.5,-11.04; 7 2.4,-10.64; 8 1.3,-10.64 | smd 1.8 x 1.4: CD1 2,-0.44; CD2 8,-0.44 | smd 1.4 x 1.9: MT1 0.4,-13.54; MT2 13.6,-14.44

### Placement (x,y rotation side)
3V3.  12.88,34.57 180 top
10V.  28.5,59.79 270 top
BATT  38.15,28.42 180 top
C1  21.89,76.3 0 top
C2  39.93,76.43 90 top
C2_H  29.51,61.32 0 top
C2_L  10.95,64.87 180 top
C3  45.52,76.43 90 top
C4  51.1,76.43 90 top
C5  56.69,76.43 90 top
C6  62.41,76.43 90 top
C7  68.12,76.43 90 top
C8  74.09,76.3 90 top
C9  71.68,71.22 90 top
C10  48.56,55.22 270 top
C11  53.64,71.22 90 top
C12  59.49,51.54 270 top
C13  9.7,59.98 0 top
C14  9.7,57.75 0 top
C15  9.7,55.52 0 top
C16  9.7,53.29 0 top
C17  9.7,51.06 0 top
C18  9.7,48.83 0 top
C19  9.7,46.6 0 top
C20  9.7,62.2 0 top
C21  9.7,44.37 0 top
C22  9.7,42.14 0 top
C23  23.8,68.05 0 top
C24  14.53,62.2 0 top
C25  14.53,59.98 0 top
C26  14.53,57.75 0 top
C27  14.53,55.52 0 top
C28  14.53,53.29 0 top
C29  14.53,51.06 0 top
C30  14.53,48.83 0 top
C31  14.53,46.6 0 top
C32  14.53,44.37 0 top
C33  14.53,42.14 0 top
C34  19.1,64.24 0 top
C35  19.1,61.95 0 top
C36  19.1,59.66 0 top
C37  19.1,57.25 0 top
C38  19.1,54.97 0 top
C39  19.1,52.68 0 top
C40  19.1,50.27 0 top
C41  19.1,47.73 0 top
C42  19.1,45.19 0 top
C43  19.1,42.65 0 top
C44  23.67,65.13 0 top
C45  23.67,62.59 0 top
C46  23.67,59.92 0 top
C47  23.67,57.12 0 top
C48  23.67,54.46 0 top
C49  23.67,51.66 0 top
C50  23.67,48.74 0 top
C51  23.67,45.69 0 top
C52  23.67,42.9 0 top
C53  46.41,63.6 180 top
C54  62.92,67.54 0 top
C55  65.07,64.62 0 top
C56  56.06,73.63 90 top
C57  59.74,69.32 0 top
C58  27.97,7.06 0 top
CM1  35.1,47.35 180 top
D1  9.32,35.53 270 top
D2  27.36,66.4 270 top
D5  32.18,34.44 180 top
D6  39.04,34.39 0 top
H4  5.97,89.13 0 top
H6  87,89.15 0 top
H7  5.97,6.17 0 top
H8  75.49,6.12 0 top
HES1  17.83,89.38 180 top
HES2  27.07,89.38 180 top
HES3  36.31,89.38 180 top
HES4  45.55,89.38 180 top
HES5  54.79,89.38 180 top
HES6  64.03,89.38 180 top
HES7  73.27,89.38 180 top
HES8  87.51,73.13 270 top
HES9  87.51,62.41 270 top
IC1  31.39,17.48 0 top
JP1  67.23,29.51 180 top
JP2  79.3,47.22 90 top
JP3  87.51,28.32 90 top
L1  10.85,73.76 270 top
L2  28.75,74.14 270 top
POE.  30.05,27.91 180 top
POE_IN  20.62,30.96 90 top
Q1  44.63,46.46 270 top
Q2  55.93,35.79 270 top
Q3  55.93,39.34 270 top
Q4  44.63,42.9 270 top
Q6  44.63,50.01 270 top
R1  18.59,76.3 0 top
R1_H  31.04,63.98 0 top
R1_L  19.35,67.41 180 top
R2  37.77,76.3 270 top
R2_H  29.64,55.47 180 top
R2_L  14.27,65 180 top
R3  43.36,76.17 270 top
R4  48.95,76.17 270 top
R5  54.53,76.3 270 top
R6  60.25,76.3 270 top
R7  65.96,76.3 270 top
R8  71.93,76.3 270 top
R9  73.84,71.22 270 top
R10  48.18,46.11 270 top
R11  59.23,34.96 270 top
R12  60.63,39.44 0 top
R13  47.93,42.52 270 top
R14  49.33,35.28 0 top
R15  41.58,46.62 90 top
R16  52.88,35.85 90 top
R17  52.88,39.44 90 top
R18  41.58,43.03 90 top
R20  41.07,49.38 0 top
R21  47.93,49.63 270 top
R23  32.49,10.79 270 top
R25  30.15,31.09 90 top
R26  12.98,37.44 90 top
R27  28.37,58.14 0 top
RS_H  43.48,71.09 0 top
RS_L  9.42,67.31 180 top
SD  35.33,10.84 180 top
SM_STAT  50.85,28.55 0 top
U1  19.61,71.86 0 top
U2  37.39,70.71 0 top
U4  55.73,60.93 270 top
X1  56.69,70.84 0 top
X2  43.41,22.07 0 top

### Tracks (layer width: path | path; a pad name or v marks a point on that pad's centre or on a via)
+3V3  (via drill 0.35, 0.45)
  Top 0.305: C10.1 48.69,56.16 v48.69,57.25 48.72,57.23 49.94,57.23 U4.32 | v34.21,52.81 35.74,52.81 37.64,50.9 CM1.1 | 13.53,49.89 13.6,49.95 16.5,49.95 16.82,50.27 v16.82,51.41 | v47.3,61.32 47.28,61.33 C53.1 47.36,63.69 U4.19 | C11.1 v53.65,68.94 53.65,68.19 53.48,68.02 U4.13 | v59.87,65.13 60.31,64.69 U4.64 64.13,64.69 C55.1 | C12.1 59.74,52.67 v59.74,53.44 59.74,54.3 59.48,54.56 U4.48 | R26.2 11.98,38.14 11.18,37.34 11.18,19.56 16.13,14.61 26.75,14.61 IC1.1 26.96,14.39 C58.1 26.96,5.04 28.32,3.68 47.12,3.68 49.17,5.74 49.17,10.97 X2.4
  Top 0.61: v13.51,67.03 13.47,66.99 R2_L.2 13.47,62.26 C24.1 C25.1 C26.1 C27.1 C28.1 C29.1 13.53,49.89 C30.1 C31.1 C32.1 C33.1 13.53,40.25 12.98,39.7 R26.2 | R1.1 15.29,76.3 14.45,77.14 9.6,77.14 L1.3 | R2.1 v37.77,78.84 | R3.1 v43.36,78.84 | R4.1 v48.95,78.84 | R5.1 v54.53,78.84 | R6.1 v60.25,78.84 | R7.1 v65.96,78.84 | R8.1 v71.93,78.84 | R9.1 v73.84,73.38
  Bottom 0.305: v16.82,51.41 16.82,52.17 17.45,52.81 v34.21,52.81 34.21,51.05 38.15,47.12 | v53.65,68.94 53.65,66.78 53.77,66.78 | 53.77,66.78 53.77,63.86 | 53.77,63.86 52.88,62.97 51.66,62.97 51.16,62.46 51.1,62.46 | 51.1,62.46 49.58,62.46 48.44,61.32 v47.3,61.32 43.33,61.32 41.78,62.87 41.78,64.59 44.63,67.44 44.63,80.24 | v59.87,65.13 58.22,66.78 53.77,66.78 | v59.74,53.44 58.09,53.44 56.44,55.09 56.44,61.19 53.77,63.86 | v48.69,57.25 48.69,58.9 51.1,61.32 51.1,62.46
  Bottom 0.61: 37.77,79.6 38.41,80.24 43.36,80.24 | v37.77,78.84 37.77,79.6 | 71.93,79.86 v71.93,78.84 | 71.93,79.86 73.08,79.86 73.84,79.1 73.84,74.65 | v73.84,73.38 73.84,74.65 | 73.84,74.65 74.85,74.65 79.3,70.21 79.3,62.46 JP2.27 | 43.36,80.24 v43.36,78.84 | 43.36,80.24 44.63,80.24 48.95,80.24 | 48.95,80.24 v48.95,78.84 | 48.95,80.24 54.53,80.24 | 54.53,80.24 v54.53,78.84 | 54.53,80.24 60.25,80.24 | 60.25,80.24 v60.25,78.84 | 60.25,80.24 65.96,80.24 | 65.96,80.24 v65.96,78.84 | 65.96,80.24 71.55,80.24 71.93,79.86 | 37.77,79.6 9.32,79.6 8.26,78.54 L1.3 8.26,74.19 13.51,68.94 v13.51,67.03
+10V
  Top 0.61: C52.1 C51.1 C50.1 C49.1 C48.1 C47.1 C46.1 C45.1 C44.1 22.17,67.92 C23.1 | R27.2 29,58.07 29,55.47 28.37,55.47 R2_H.2
  Top 0.813: HES2.1 29.61,91.06 | 29.61,91.06 28.75,91.92 21.01,91.92 20.37,91.29 HES1.1 20.37,83.44 26.16,77.65 L2.3 26.16,74.85 23.93,72.62 23.93,68.55 23.55,68.17 22.43,68.17 C23.1 | 29.61,91.06 30.47,91.92 38.02,91.92 38.85,91.1 | HES3.1 38.85,91.1 | 38.85,91.1 39.55,91.8 46.91,91.8 48.09,90.62 HES4.1 48.09,90.94 48.95,91.8 56.19,91.8 57.33,90.65 HES5.1 57.33,90.91 58.09,91.67 65.58,91.67 66.57,90.68 HES6.1 66.57,90.75 67.61,91.8 74.85,91.8 75.81,90.84 HES7.1 75.81,85.19 85.33,75.67 HES8.1 88.7,75.67 89.92,74.45 89.92,66.19 88.68,64.95 HES9.1 | JP1.10 59.66,25.76 16.94,25.76 13.26,29.44 13.26,32.23 22.17,41.15 | C52.1 22.17,41.15 | 22.17,41.15 22.17,40.64 25.98,40.64 26.98,41.63 26.98,51.66 28.37,53.06 28.37,55.47
  Bottom 0.813: JP1.10 JP1.8 JP1.6 JP1.4 JP1.2 77.95,28.24 JP2.2
BOOT0  (via drill 0.35)
  Top 0.305: v64.06,62.97 63.55,62.97 63.27,62.69 U4.60
  Bottom 0.305: v64.06,62.97 68.76,62.97 75.62,56.11 JP2.24
BUZZ  (via drill 0.35)
  Top 0.305: R13.2 47.93,37.82 46.66,36.55 46.66,33.38 47.68,32.36 v55.68,32.36
  Bottom 0.305: JP1.1 71.09,29.57 61.01,29.57 58.22,32.36 v55.68,32.36
GND  (via drill 0.35, 0.45)  (235 unrouted)
  other vias: 55.8,59.03 59.23,62.2 67.36,61.7 73.71,62.59 74.73,51.66 74.73,50.39 67.74,45.31 61.9,46.46 67.87,42.77 74.6,54.2 76,52.93 75.11,35.41 70.54,35.53 64.69,35.66 60.25,32.11 48.69,36.42 49.33,33.63 51.49,34.52 60.12,63.86 51.61,58.14 45.14,62.46 57.58,69.19 59.11,54.08 77.39,85.95 80.82,90.4 74.85,29.95 69.39,38.46 60.12,44.17 58.72,28.68 48.95,52.81 67.87,50.77 72.19,57.76 59.61,59.16 62.53,66.01 74.6,67.92 70.54,73.13 63.3,73.13 59.87,72.75 49.58,73 49.58,68.43 58.34,78.46 69.39,78.46 42.21,79.1 46.66,70.33 39.04,67.16 35.1,77.32 35.86,74.27 33.45,61.95 40.69,62.08 33.58,55.09 36.75,55.85 36.63,58.27 29.51,42.01 45.39,38.71 37.13,30.84 43.87,31.47 27.1,27.66 20.62,27.79 18.08,34.52 24.05,38.96 13.77,25.5 6.65,33.88 15.29,40.11 10.85,40.11 6.27,47.98 6.15,54.46 6.65,63.73 15.93,63.6 26.97,61.95 26.59,53.82 20.88,49 20.88,43.92 21.13,58.52 16.81,58.39 16.18,68.55 6.91,69.32 10.34,75.67 28.63,71.35 28.88,77.32 11.48,69.44 15.67,77.83 7.54,79.73 13.26,90.91 17.53,84.96 22.61,84.96 29.08,84.96 39.62,84.96 50.04,85.34 58.93,86.87 81.79,83.69 78.99,73.15 86.36,55.75 88.52,49.91 77.09,20.83 68.71,21.08 60.71,20.32 54.23,20.45 42.04,21.08 16.38,21.59 14.73,7.75 37.34,6.98 37.34,17.02 47.62,16.64 45.09,6.98 59.69,9.53 64.39,9.65 87,8.64 81.66,8.26 69.6,16 60.96,15.24 6.35,13.34 8.76,28.32 2.54,47.88 2.29,62.48 2.54,78.74 33.02,81.41 13.21,84.33 90.42,84.07 52.83,5.97 52.07,62.36 54.1,60.58 33.66,12.32 69.09,40.26 87.5,68.07
  pour Bottom: 0,0.13 0,95.12 93.09,95.12 93.09,0.13
  pour Top: 0,-0.13 0,95 93.22,95 93.22,-0.13
IN_CTS  (via drill 0.35)
  Top 0.305: v53.14,42.65 53.14,45.82 57.48,50.16 U4.44
  Bottom 0.305: SM_STAT.4 53.14,28.8 v53.14,42.65
IN_H1  (via drill 0.35)
  Top 0.305: v42.98,73.38 46.91,73.38 52.48,67.82 U4.15 | v21.01,74.78 21.01,76.26 C1.1
  Top 0.61: C1.1 R1.2 19.44,78.37 15.29,82.52 HES1.3
  Bottom 0.305: v42.98,73.38 21.64,73.38 21.01,74.02 v21.01,74.78
  Bottom 0.61: HES1.3 5.33,79.43 5.33,28.83 29.46,4.7 62.74,4.7 72.52,14.48 87.38,14.48 JP3.1
IN_H2  (via drill 0.45)
  Top 0.305: C2.1 39.93,75.41 42.81,72.53 46.97,72.53 51.98,67.52 U4.16
  Top 0.61: HES2.3 24.53,82.81 27.99,79.35 30.15,79.35 33.83,75.67 37.7,75.67 R2.2 38.36,75.55 C2.1 | v30.73,93.47 76.68,93.47 80.51,89.64 80.67,89.64 91.19,79.12 91.19,18.67 89.41,16.89 JP3.2
  Bottom 0.61: v30.73,93.47 25.65,93.47 24.53,92.35 HES2.3
IN_H3  (via drill 0.35)
  Top 0.305: v48.69,65.25 49.61,65.25 49.98,64.88 U4.17 | v45.52,74.14 C3.1
  Top 0.61: C3.1 43.36,75.55 R3.2 42.79,75.47 41.58,76.68 41.58,78.46 33.77,86.27 HES3.3
  Bottom 0.305: v48.69,65.25 47.68,65.25 45.52,67.41 v45.52,74.14
  Bottom 0.61: HES3.3 33.77,86.37 37.85,82.3 73.15,82.3 82.17,73.28 82.17,22.36 85.1,19.43 JP3.3
IN_H4  (via drill 0.35)
  Top 0.305: v51.36,63.6 50.94,63.19 U4.20 | v52.12,69.7 52.12,71.77 51.1,72.78 C4.1
  Top 0.61: C4.1 48.95,75.55 R4.2 48.07,75.47 47.89,75.45 47.17,76.17 47.17,78.71 42.98,82.91 42.98,89.35 HES4.3
  Bottom 0.305: v51.36,63.6 52.12,64.36 v52.12,69.7
  Bottom 0.61: HES4.3 43.01,88.05 47.24,83.82 73.53,83.82 83.19,74.17 83.19,24.01 85.22,21.97 JP3.4
IN_H5
  Top 0.305: C5.1 57.71,74.56 63.89,74.56 66.98,71.48 66.98,63.6 65.56,62.19 U4.59
  Top 0.61: C5.1 55.13,75.55 R5.2 53.88,75.6 53.62,75.56 52.25,76.94 HES5.3
  Bottom 0.61: HES5.3 52.25,87.83 54.74,85.34 74.55,85.34 84.33,75.56 84.33,25.91 85.73,24.51 JP3.5
IN_H6
  Top 0.305: 63.8,75.58 67.61,71.77 67.61,63.35 65.96,61.7 U4.58 | 63.8,75.58 C6.1 | 63.8,75.58 63.61,75.77 63.61,75.86
  Top 0.61: R6.2 60.84,75.55 C6.1 63.34,75.58 63.61,75.86 64.06,76.3 64.06,79.22 61.49,81.79 HES6.3
  Bottom 0.61: HES6.3 61.49,88.25 62.74,86.99 74.93,86.99 85.47,76.45 85.47,27.95 86.37,27.05 JP3.6
IN_H7
  Top 0.305: C7.1 68.25,75.45 68.25,60.94 65,57.69 U4.50
  Top 0.61: R7.2 66.56,75.55 C7.1 69.31,75.58 70.73,77 HES7.3
  Bottom 0.61: HES7.3 70.73,90.4 72.25,91.92 76.22,91.92 91.06,77.09 91.06,31.36 89.29,29.59 JP3.7
IN_H8
  Top 0.305: R8.2 70.83,75.45 69.65,74.27 69.65,61.32 64.57,56.24 56.19,56.24 55.99,56.04 U4.41
  Top 0.61: R8.2 C8.1 79.93,75.43 84.77,70.59 HES8.3
  Bottom 0.61: HES8.3 89.66,68.43 89.66,33.27 88.52,32.13 JP3.8
IN_H9  (via drill 0.35)
  Top 0.305: v52.86,69.04 52.86,68.08 52.99,67.95 U4.14 | v70.54,70.46 71.59,70.46 C9.1
  Top 0.61: C9.1 R9.2 80.23,70.52 83.06,67.69 83.06,62.36 85.55,59.87 HES9.3 87.51,54.62 84.58,51.69 84.58,36.2 86.11,34.67 JP3.9
  Bottom 0.305: v52.86,69.04 52.86,69.93 54.79,71.86 68.12,71.86 69.52,70.46 v70.54,70.46
IN_RTS  (via drill 0.35)
  Top 0.305: v54.03,41.76 54.03,45.95 57.99,49.91 57.99,55.17 U4.45
  Bottom 0.305: v54.03,41.76 54.03,32.61 55.93,30.71 SM_STAT.5
IN_UART-RX  (via drill 0.35)
  Top 0.305: R14.2 50.18,36.89 v50.22,36.93 | v52.5,41.76 52.5,45.95 56.98,50.42 U4.43
  Bottom 0.305: v50.22,36.93 50.22,37.69 52.5,39.98 v52.5,41.76
IN_UART-TX  (via drill 0.35)
  Top 0.305: v51.87,43.03 51.87,46.08 56.5,50.71 56.5,55.16 U4.42
  Bottom 0.305: SM_STAT.1 45.77,35.28 51.87,41.38 v51.87,43.03
LED0  (via drill 0.35)
  Top 0.305: R21.2 48.91,48.78 49.84,47.85 49.84,37.41 49.37,36.95 49.37,34.47 50.22,33.63 v55.55,33.63 | JP1.9 62.15,33 61.52,33.63 v60.76,33.63
  Bottom 0.305: v60.76,33.63 v55.55,33.63
LED1  (via drill 0.35)
  Top 0.305: R10.2 48.82,45.26 49.2,44.88 49.2,37.95 47.55,36.3 47.55,33.63 48.18,33 v54.91,33
  Bottom 0.305: JP1.7 64.69,31.72 63.42,33 v54.91,33
LED2
  Top 0.305: R11.2 59.23,31.09 60.76,29.57 66.02,29.57 JP1.5
LED3
  Top 0.305: R12.2 63.96,39.44 69.77,33.63 JP1.3
N$1
  Top 0.305: R13.1 47.46,42.9 Q4.3
N$2
  Top 0.61: RS_L.1 10.27,71.41 12.62,73.76 U1.1 U1.8 U1.7
N$3  (via drill 0.45)
  Top 0.61: D1.C v9.32,39.85 | L1.1 13.79,72.49 U1.2
  Bottom 0.61: v9.32,39.85 9.32,60.17 14.66,65.51 14.66,69.71 13.08,71.29 L1.1
N$4
  Top 0.61: C2_L.1 11.86,64.87 11.86,68.17 14.91,71.22 U1.3
N$5
  Top 0.61: R2_L.1 15.07,66.02 16.47,67.41 R1_L.2 18.55,68.52 19.99,69.95 U1.5
N$6
  Top 0.305: SD.A 35.33,11.84 33.93,13.24 33.93,17.25 34.57,17.88 IC1.10
N$7
  Top 0.305: R21.1 47.46,50.01 Q6.3
N$8
  Top 0.305: IC1.2 28.22,11.46 28.19,11.43 28.19,10.54 32.51,6.23 47.9,6.23 48.01,6.34 X2.5
N$9  (via drill 0.35)
  Top 0.305: v62.79,56.87 62.48,57.19 U4.49 | v63.68,54.59 63.68,43.41 60.63,40.36 60.63,35.66 59.98,35.01 58.33,35.01 57.58,34.27 57.58,31.98 56.69,31.09 46.91,31.09 39.88,38.12 39.88,39.75 36.37,43.26 CM1.4
  Bottom 0.305: v62.79,56.87 63.68,55.98 v63.68,54.59
N$10
  Top 0.61: U2.7 U2.8 | U2.8 41.12,72.62 42.63,71.11 RS_H.1 | U2.1 U2.8
N$12
  Top 1.016: POE_IN.PWR1 17.32,30.96 19.86,33.5 27.36,33.5 28.3,34.44 D5.A | D5.A 30.13,31.81 R25.2 | 32.56,38.96 31.58,37.98 29.19,37.98 29.19,36.85 30.13,35.91 D5.A
N$13
  Top 0.305: Q3.3 59.88,39.35 R12.1
N$14
  Top 0.813: POE..A 30.05,30.29 R25.1
N$15
  Top 0.61: U2.2 34.42,70.84 32.31,70.84 | 32.31,70.84 29.77,68.3 D2.C | L2.1 32.31,70.84
N$16
  Top 1.016: BATT.1 39.42,30.58 41.09,32.25 D6.A
N$17
  Top 0.61: 3V3..A 12.88,36.64 R26.1
N$18
  Top 0.61: C2_H.1 28.68,62.73 28.79,62.84 28.79,64.91 33.96,70.08 U2.3
N$19
  Top 0.61: R2_H.1 31.71,56.14 31.71,63.86 R1_H.2 32.73,63.98 37.55,68.81 U2.5
N$20
  Top 0.305: IC1.6 33.3,13.11 32.49,12.29 R23.1 33.72,11.49 34.42,10.79 38.48,10.79 43.31,15.62 49.53,15.62 51.31,13.84 X2.2
N$21
  Top 0.61: R27.1 27.62,58.19 27.62,59.66 10V..A
N$22
  Top 0.305: R23.2 SD.C
N$23
  Top 0.305: IC1.4 30.73,14.38 30.73,10.16 31.88,9.02 38.23,9.02 43.94,14.73 48.9,14.73 50.21,13.42 X2.3
N$26
  Top 0.305: R10.1 47.17,46.96 46.67,46.46 Q1.3
N$27
  Top 0.305: Q2.3 59.21,35.79 R11.1
N$30
  Top 0.305: CM1.2 37.64,43.54 42.85,38.33 42.85,36.3 47.42,31.72 56.31,31.72 56.69,32.11 56.69,33.63 56.06,34.27 56.06,47.22 58.48,49.64 U4.46
N$32
  Top 0.305: U4.7 56.5,66.66 56.5,64.81 56.19,64.49 52.88,64.49 50.09,67.28 44.12,67.28 39.55,62.71 39.55,48.49 38.41,47.35 33.07,47.35 32.56,46.84 CM1.10
OSC_IN
  Top 0.305: X1.3 58.63,71.57 59.14,71.06 C57.1 58.6,69.32 57.48,68.2 U4.5
OSC_OUT
  Top 0.305: C56.1 56.15,73.13 56.69,73.13 56.93,72.89 56.93,70.08 56.89,70.12 X1.1 55.67,69.38 56.98,68.07 U4.6
OUT_BUZZ
  Top 0.305: R18.2 43.46,43.88 Q4.1 44.18,43.85 44.88,44.55 44.88,58.9 46.16,60.19 U4.26
OUT_CLK  (via drill 0.35)
  Top 0.305: v38.1,21.21 37.44,20.55 IC1.9 | IC1.3 29.49,16.03 v30.48,17.02 | U4.29 48.96,58.69 48.7,58.42 v47.88,58.42
  Bottom 0.305: v30.48,17.02 33.02,19.56 36.45,19.56 v38.1,21.21 38.1,22.35 35.56,24.89 35.56,31.07 39.47,34.98 39.47,57.18 40.72,58.42 v47.88,58.42
OUT_CS  (via drill 0.35)
  Top 0.305: v45.9,57.51 45.9,58.9 46.68,59.69 U4.27 | IC1.7 34.57,15.71 38.77,19.91 v38.73,19.94
  Bottom 0.305: v45.9,57.51 45.9,57 40.89,51.99 40.89,22.1 v38.73,19.94
OUT_DI  (via drill 0.35)
  Top 0.305: IC1.5 32.03,16.56 32.66,17.2 32.66,22 35.18,24.51 v44.83,24.51 | v55.88,62.87 55.88,62.74 55.37,62.23 v54.36,62.23 | U4.10 54.99,66.67 v54.99,65.28
  Bottom 0.305: v44.83,24.51 45.85,24.51 46.23,24.89 46.23,25.65 45.59,26.29 44.7,26.29 43.81,27.18 43.81,30.56 44.47,31.22 44.47,52.09 52.2,59.82 52.2,61.21 53.21,62.23 v54.36,62.23 | v54.99,65.28 54.99,64.39 55.37,64.01 55.39,64.01 55.88,63.51 v55.88,62.87
OUT_DO  (via drill 0.35)
  Top 0.305: v41.91,51.44 41.91,63.5 v42.55,64.13 | v45.97,13.72 45.97,11.6 X2.7 | v52.58,72.64 53.34,73.41 53.98,73.41 54.74,72.64 54.74,67.94 54.48,67.69 U4.11
  Bottom 0.305: v45.97,13.72 45.97,19.81 41.91,23.88 v41.91,51.44 | v52.58,72.64 50.42,70.48 50.42,65.41 49.53,64.52 42.93,64.52 v42.55,64.13
OUT_LED0
  Top 0.305: R20.2 41.92,50.42 42.47,50.97 Q6.1 43.48,65.63 44.5,66.65 49.96,66.65 52.66,63.95 58.81,63.95 59.57,63.19 U4.61
OUT_LED1
  Top 0.305: R15.2 43.43,47.47 Q1.1 43.93,47.41 44.37,47.85 44.37,65.25 45.01,65.89 49.96,65.89 52.96,62.89 52.96,62.65 54.42,61.19 U4.57
OUT_LED2
  Top 0.305: Q2.1 54.75,36.7 R16.2 52.86,36.68 51.87,36.68 50.34,38.21 50.34,55.86 52.62,58.15 53.78,58.15 54.59,58.96 54.59,60.11 55.16,60.69 U4.56
OUT_LED3
  Top 0.305: Q3.1 52.89,40.3 R17.2 51.81,40.29 50.98,41.12 50.98,55.6 52.88,57.51 53.9,57.51 55.17,58.78 55.17,59.79 55.56,60.19 U4.55
PB2  (via drill 0.35)
  Top 0.305: v46.91,57.63 46.91,58.78 47.32,59.19 U4.28
  Bottom 0.305: v46.91,57.63 46.91,55.98 42.85,51.92 42.85,24.74 43.99,23.6 75.92,23.6 80.49,28.17 JP2.1
PB9  (via drill 0.35)
  Top 0.305: v62.79,63.73 62.74,63.69 U4.62
  Bottom 0.305: v62.79,63.73 69.52,63.73 74.6,58.65 JP2.26
PB11  (via drill 0.35)
  Top 0.305: v52.38,59.03 52.38,59.54 52.12,59.79 51.36,59.79 50.98,59.41 50.98,58.4 50.77,58.19 U4.30
  Bottom 0.305: JP2.5 79.3,34.52 63.55,34.52 50.85,47.22 50.85,55.86 52.38,57.38 v52.38,59.03
PB12  (via drill 0.35)
  Top 0.305: v51.74,49.89 51.74,51.65 51.98,51.88 U4.33
  Bottom 0.305: v51.74,49.89 51.74,47.22 61.9,37.06 79.3,37.06 JP2.7
PB13  (via drill 0.35)
  Top 0.305: v52.5,49 52.46,49.04 52.46,55.17 U4.34
  Bottom 0.305: v52.5,49 52.5,48.11 60.96,39.65 79.25,39.65 JP2.9
PB14  (via drill 0.35)
  Top 0.305: v53.77,50.01 52.99,50.79 52.99,55.18 U4.35
  Bottom 0.305: v53.77,50.01 55.68,48.11 57.84,48.11 63.8,42.14 79.3,42.14 JP2.11
PB15  (via drill 0.35)
  Top 0.305: v54.41,51.54 54.38,51.54 53.48,52.44 U4.36
  Bottom 0.305: v54.41,51.54 55.04,50.9 58.34,50.9 64.57,44.68 79.3,44.68 JP2.13
PC0  (via drill 0.35)
  Top 0.305: v55.98,67.92 55.95,67.89 55.98,67.86 U4.8
  Bottom 0.305: v55.98,67.92 55.98,69.49 56.82,70.33 67.23,70.33 76.38,61.19 JP2.28
PC1  (via drill 0.35)
  Top 0.305: v71.04,49.63 74.6,46.08 74.6,37.19 76,35.79 JP2.8 | U4.9 55.49,65.93 55.88,65.53 v55.88,65.15
  Bottom 0.305: v71.04,49.63 62.79,57.89 62.28,57.89 55.88,64.29 v55.88,65.15
PC4  (via drill 0.35)
  Top 0.305: v53.01,61.06 53.01,61.44 52.76,61.7 51.45,61.7 50.94,61.19 U4.24
  Bottom 0.305: v53.01,61.06 53.01,49.51 61.57,40.95 77.95,40.95 JP2.12
PC5  (via drill 0.35)
  Top 0.305: v53.77,59.16 53.77,59.92 53.39,60.3 51.32,60.3 50.94,60.69 U4.25
  Bottom 0.305: v53.77,59.16 53.77,50.9 55.3,49.38 57.84,49.38 63.73,43.48 77.95,43.48 JP2.14
PC6  (via drill 0.35)
  Top 0.305: v54.41,52.68 53.94,53.15 53.94,55.14 U4.37
  Bottom 0.305: v54.41,52.68 55.42,51.66 58.73,51.66 64.36,46.03 77.95,46.03 JP2.16
PC7  (via drill 0.35)
  Top 0.305: v54.69,53.75 54.69,54.2 54.48,54.41 U4.38
  Bottom 0.305: v54.69,53.75 54.69,53.29 55.42,52.55 59.11,52.55 63.09,48.57 77.95,48.57 JP2.18
PC8  (via drill 0.35)
  Top 0.305: v57.07,57.76 56.06,57.76 54.97,56.67 54.97,56.18 54.98,56.17 U4.39 | JP2.6 75.87,33.25 73.84,35.28 73.84,42.52 v65.71,50.65
  Bottom 0.305: v57.07,57.76 58.6,57.76 v65.71,50.65
PC9  (via drill 0.35)
  Top 0.305: v57.58,57 56.06,57 55.48,56.42 U4.40 | JP2.4 76.25,30.71 73.08,33.88 73.08,42.27 v64.69,50.65
  Bottom 0.305: v57.58,57 58.34,57 v64.69,50.65
PC10  (via drill 0.35)
  Top 0.305: v63.55,58.4 63.17,58.4 62.96,58.19 U4.51 | v72.69,49.89 75.36,47.22 75.36,39.6 76.63,38.33 JP2.10
  Bottom 0.305: v63.55,58.4 64.19,58.4 v72.69,49.89
PC11  (via drill 0.35)
  Top 0.305: v63.8,59.16 63.17,59.16 62.7,58.69 U4.52
  Bottom 0.305: v63.8,59.16 64.57,59.16 73.97,49.76 78.41,49.76 79.3,48.87 79.3,47.22 JP2.15
PC12  (via drill 0.35)
  Top 0.305: v63.8,59.92 63.17,59.92 62.44,59.19 U4.53
  Bottom 0.305: v63.8,59.92 65.08,59.92 73.97,51.03 JP2.20
PC13  (via drill 0.35)
  Top 0.305: v59.61,68.3 58.99,67.67 U4.2
  Bottom 0.305: v59.61,68.3 60.25,68.94 65.96,68.94 74.98,59.92 79.3,59.92 JP2.25
PC14-OSC32_IN  (via drill 0.35)
  Top 0.305: v58.47,65.25 58.43,65.3 58.48,65.35 U4.3
  Bottom 0.305: v58.47,65.25 58.47,64.36 61.39,61.44 65.96,61.44 72.57,54.84 79.3,54.84 JP2.23
PC15-OSC32_OUT  (via drill 0.35)
  Top 0.305: v58.73,68.3 57.98,67.55 U4.4 | v70.54,65.76 71.3,65 79.3,65 JP2.29
  Bottom 0.305: v58.73,68.3 60.12,69.7 66.6,69.7 v70.54,65.76
PD2  (via drill 0.35)
  Top 0.305: v63.8,60.68 63.17,60.68 62.17,59.69 U4.54
  Bottom 0.305: v63.8,60.68 65.46,60.68 73.84,52.3 79.43,52.3 80.57,53.44 JP2.21
POE  (via drill 0.75)
  Top 0.61: 18.1,65.74 v18.09,65.76
  Top 1.016: RS_L.2 8.7,67.18 8.7,62.21 C20.1 C13.1 C14.1 C15.1 C16.1 C17.1 C18.1 C19.1 C21.1 C22.1 7.81,42.14 7.16,41.49 v7.16,40.36 | 18.1,65.74 C34.1 C35.1 C36.1 C37.1 C38.1 C39.1 C40.1 C41.1 C42.1 C43.1 18.09,42.63 v18.09,39.85 | D5.C 36.94,34.44 D6.C 36.99,32.6 36.37,31.98 v34.85,31.98 | U1.6 v19.48,71.22 | v37.52,70.08 U2.6 40.87,70.08 41.38,69.57 43.45,69.57 44.34,70.46 RS_H.2
  Bottom 1.016: v18.09,39.85 18.09,38.58 | v34.85,31.98 27.61,31.98 22.02,37.57 19.1,37.57 18.09,38.58 | 18.09,38.58 8.31,38.58 7.16,39.73 v7.16,40.36 | v19.48,71.22 18.85,71.22 18.09,70.46 v18.09,65.76 18.21,65.89 29.01,65.89 33.2,70.08 v37.52,70.08
UART_RX  (via drill 0.35)
  Top 0.305: R14.1 48.48,33.92 v48.44,33.88
  Bottom 0.305: SM_STAT.2 48.31,32.11 48.44,32.23 v48.44,33.88
VBATT  (via drill 0.5)
  Top 0.305: U4.1 59.53,66.69
  Top 0.406: C54.1 60.38,67.54 59.53,66.69
  Top 0.61: v47.8,69.32 46.53,68.05 43.28,68.05 37.97,62.74 37.97,58.17 30.23,50.42 30.23,43.43 31.5,42.16 34.54,42.16 35.56,41.15 35.56,39.01 | v58.98,73.76 60.88,73.76 62.07,72.58 C54.1
  Bottom 0.61: v47.8,69.32 52.25,73.76 v58.98,73.76

### Text on the board
tNames: RTS CTS | RX TX | Jennifer Jordan, jejor2@pdx.edu, github.com/psas/tsar-hardware | valve_indicator_V1.1, 2021/2/21